# Altium project IMX8SoCIot.PrjPcb (part 1 of 4)
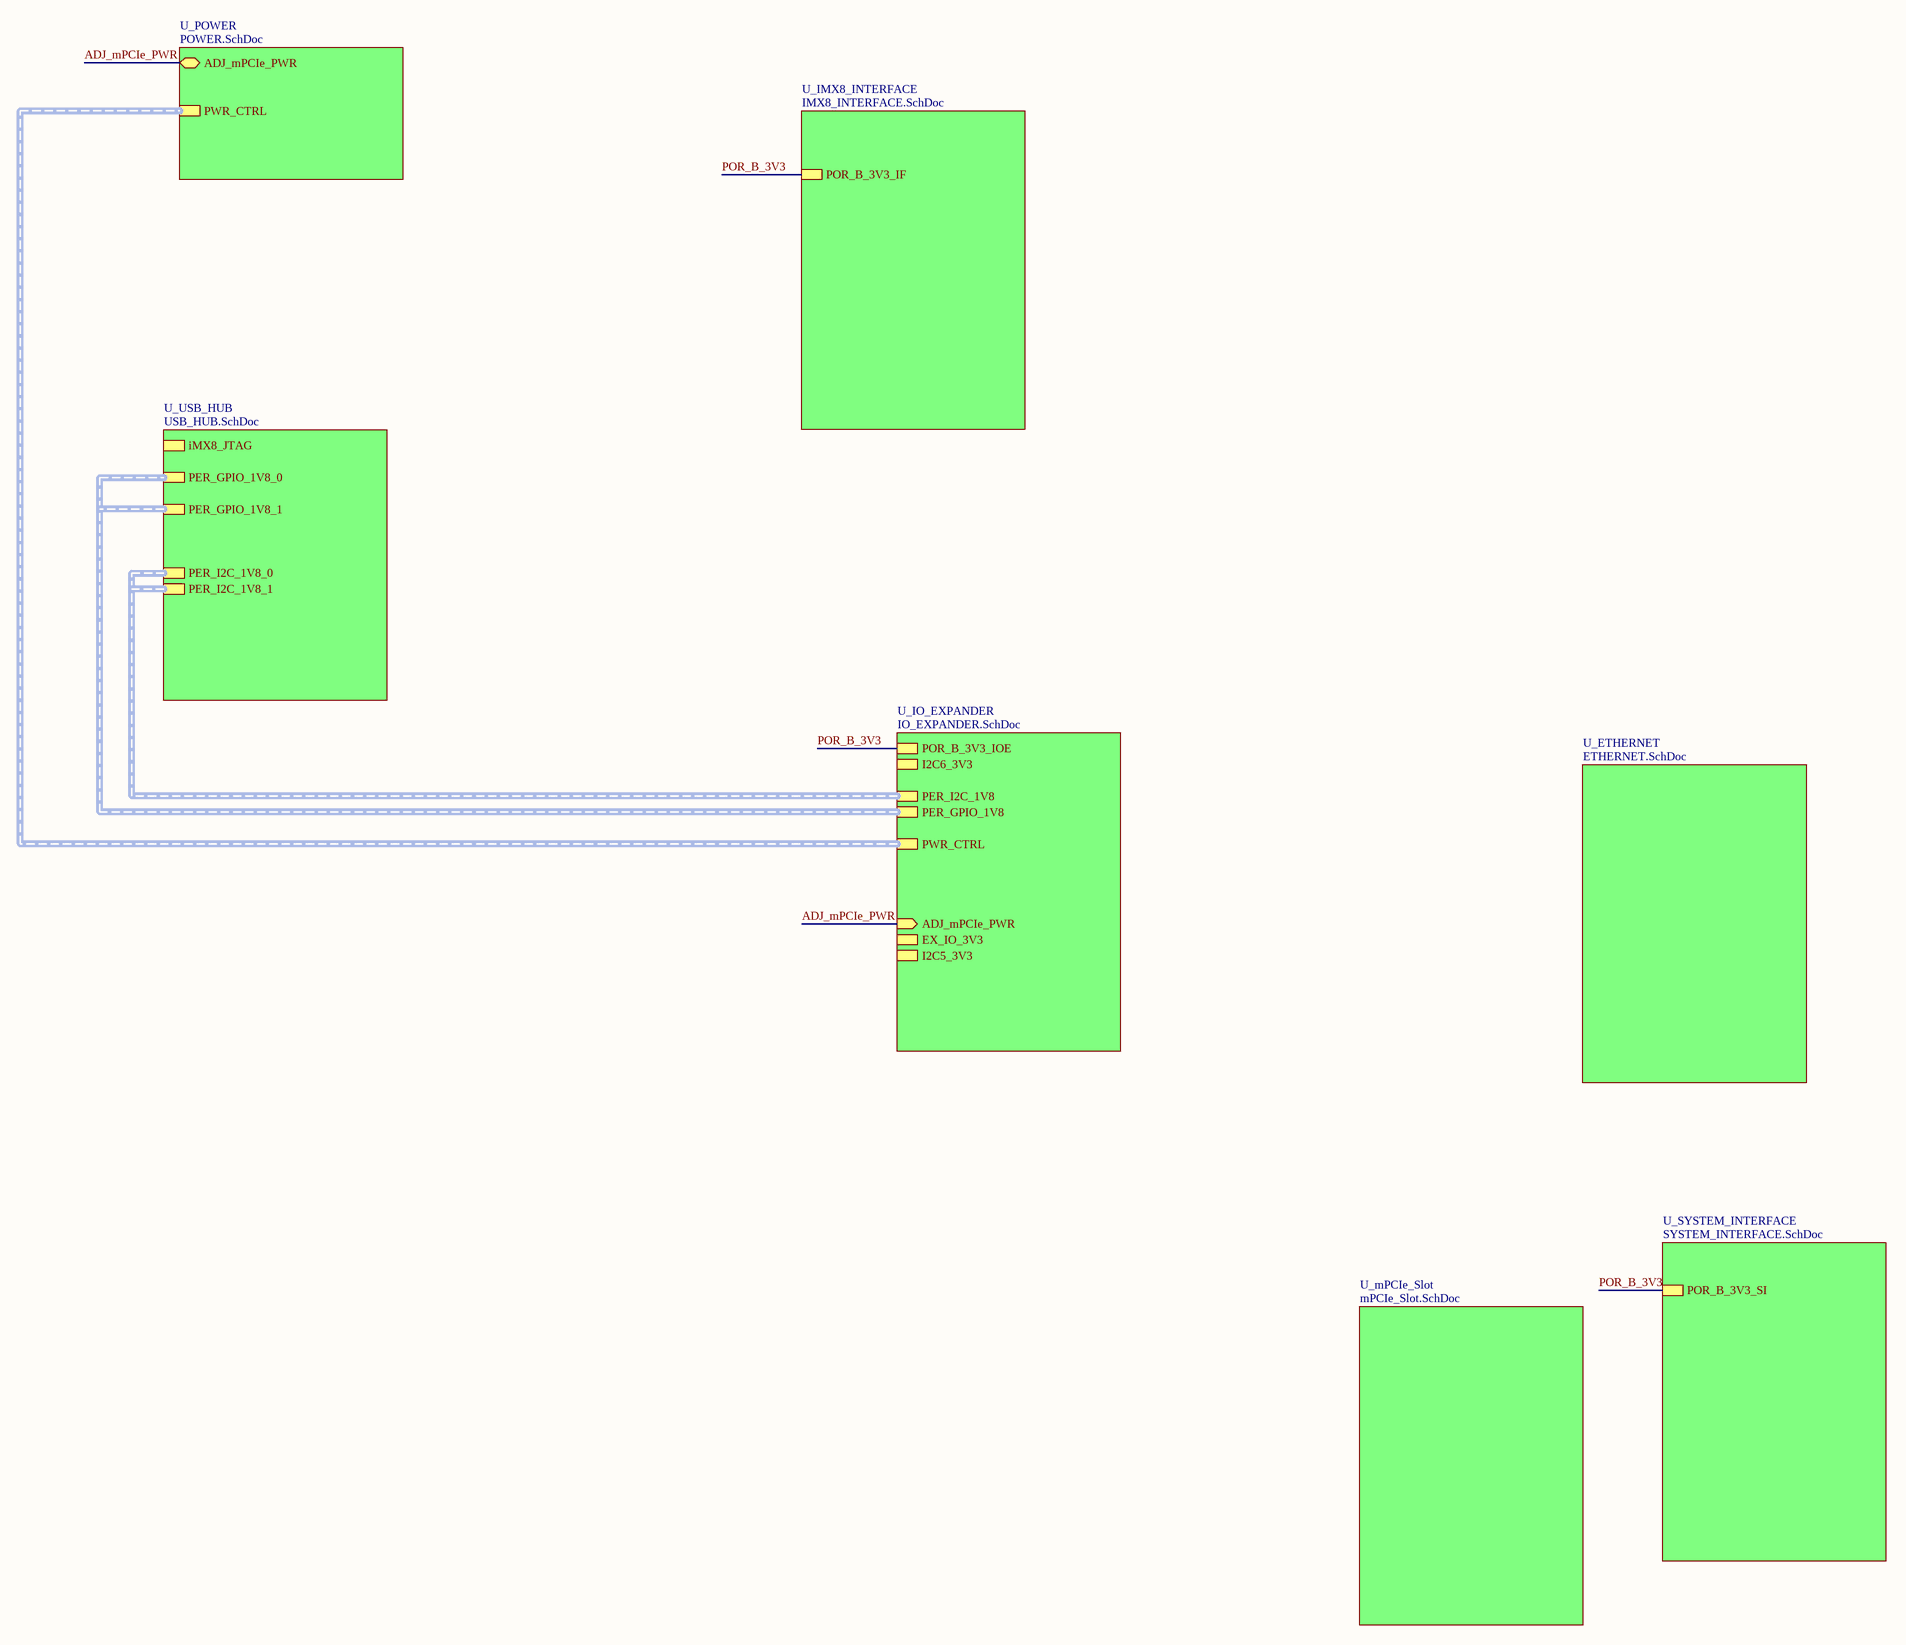
[diagram p0: TOP_LEVEL.SchDoc]
12 sheets, 243 parts. Net scope: global (net labels, ports and power ports of the same name join across sheets).
Board file: PCB1.PcbDoc
Sheets:
  TOP_LEVEL.SchDoc
    U_IMX8_INTERFACE = IMX8_INTERFACE.SchDoc
      U_IMX8_SOC = IMX8_SOC.SchDoc
        U_IMX8_DISPLAY = IMX8_DISPLAY.SchDoc
        U_IMX8_eMMC = IMX8_eMMC.SchDoc
        U_IMX8_INPUT = IMX8_INPUT.SchDoc
        U_IMX8_IO = IMX8_IO.SchDoc
        U_IMX8_LPDDR4 = IMX8_LPDDR4.SchDoc
        U_IMX8_PHY = IMX8_PHY.SchDoc
        U_IMX8_PMIC = IMX8_PMIC.SchDoc
        U_IMX8_PWR = IMX8_PWR.SchDoc
        U_Interconnect = Interconnect.SchDoc

## Sheet TOP_LEVEL.SchDoc
size 594 x 420 mm; SheetNumber: 1; SheetTotal: 20

### Sub-sheets
U_ETHERNET = ETHERNET.SchDoc (file not in this document): no entries
U_IMX8_INTERFACE = IMX8_INTERFACE.SchDoc: POR_B_3V3_IF
U_IO_EXPANDER = IO_EXPANDER.SchDoc (file not in this document): I2C6_3V3 (harness I2C6_3V3), PER_GPIO_1V8 (harness PER_GPIO_1V8), PER_I2C_1V8 (harness PER_I2C_1V8), ADJ_mPCIe_PWR (in), EX_IO_3V3 (harness EX_IO), I2C5_3V3 (harness I2C5_3V3), PWR_CTRL (harness PWR_CTRL_IOE), POR_B_3V3_IOE
U_mPCIe_Slot = mPCIe_Slot.SchDoc (file not in this document): no entries
U_POWER = POWER.SchDoc (file not in this document): ADJ_mPCIe_PWR (bidir), PWR_CTRL (harness PWR_CTRL_SMP)
U_SYSTEM_INTERFACE = SYSTEM_INTERFACE.SchDoc (file not in this document): POR_B_3V3_SI
U_USB_HUB = USB_HUB.SchDoc (file not in this document): iMX8_JTAG (harness iMX8_JTAG), PER_GPIO_1V8_0 (harness PER_GPIO_1V8_0), PER_GPIO_1V8_1 (harness PER_GPIO_1V8_1), PER_I2C_1V8_0 (harness PER_GPIO_1V8_0), PER_I2C_1V8_1 (harness PER_GPIO_1V8_1)

### Nets
ADJ_mPCIe_PWR: sheet U_POWER/ADJ_mPCIe_PWR, sheet U_IO_EXPANDER/ADJ_mPCIe_PWR
POR_B_3V3: sheet U_IMX8_INTERFACE/POR_B_3V3_IF, sheet U_IO_EXPANDER/POR_B_3V3_IOE, sheet U_SYSTEM_INTERFACE/POR_B_3V3_SI

### Buses and harness runs
harness sheet U_IO_EXPANDER/PER_GPIO_1V8 = sheet U_USB_HUB/PER_GPIO_1V8_0 = sheet U_USB_HUB/PER_GPIO_1V8_1
harness sheet U_IO_EXPANDER/PER_I2C_1V8 = sheet U_USB_HUB/PER_I2C_1V8_0 = sheet U_USB_HUB/PER_I2C_1V8_1
harness sheet U_IO_EXPANDER/PWR_CTRL = sheet U_POWER/PWR_CTRL

### Notes on the sheet
- DWG NO:
- REV:
- THIS DOCUMENT AND THE DATA DISCLOSED HEREIN OR
- HEREWITH IS THE PROPERTY OF ALTIUM LIMITED AND MAY
- BE FREELY DISTRIBUTED IN WHOLE. NO RIGHTS ARE
- RESERVED OR EXPRESS OR IMPLIED WARANTEE GIVEN.
- REVISION
- DESCRIPTION
- DATE
- APPROVED
- ENG:
- APPROVALS
- PROJECT
- DSN:
- CHK:
- REFERENCE DOCUMENTS
- PROJECT REVISION:
- TITLE
- DOCUMENT REVISION:
- DESIGN ITEM:
- BOM:
- FAB DWG:
- PCB DWG:
- ASSY DWG:
- SCALE:
- A2
- SIZE
- CAGE CODE
- FILE NAME
- DWG NO.
- SHEET
- OF
- REV

## Sheet IMX8_INTERFACE.SchDoc
size 594 x 420 mm; SheetNumber: 2; SheetTotal: 12
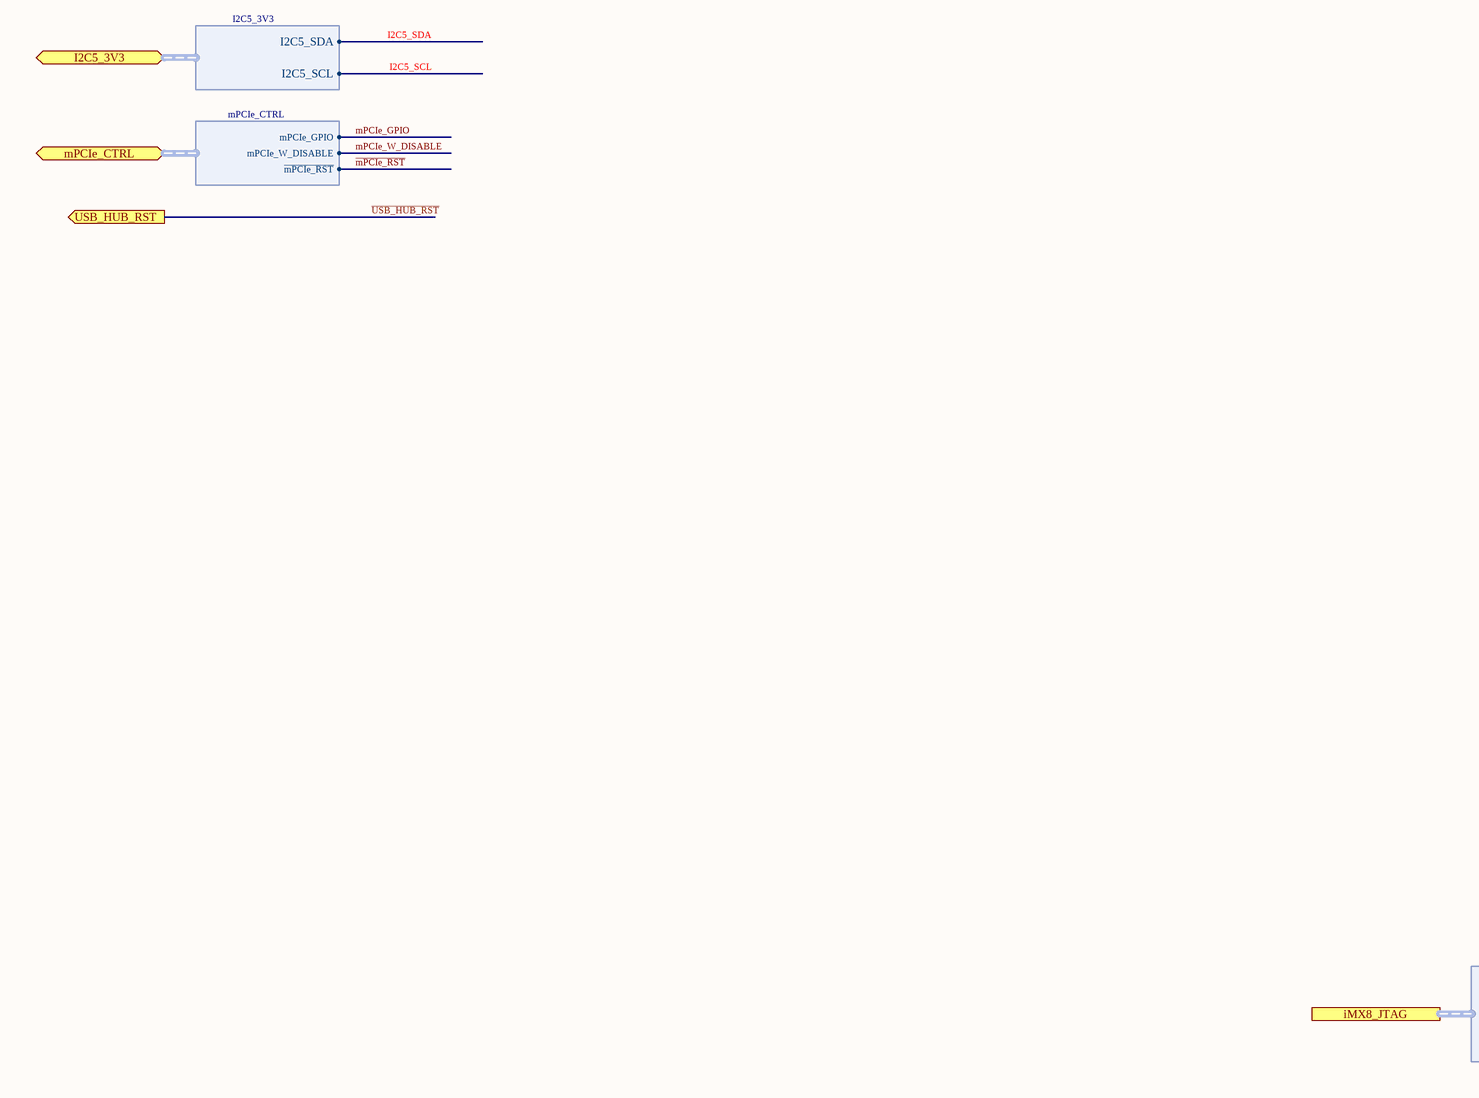
[diagram p1: IMX8_INTERFACE.SchDoc, bottom left]
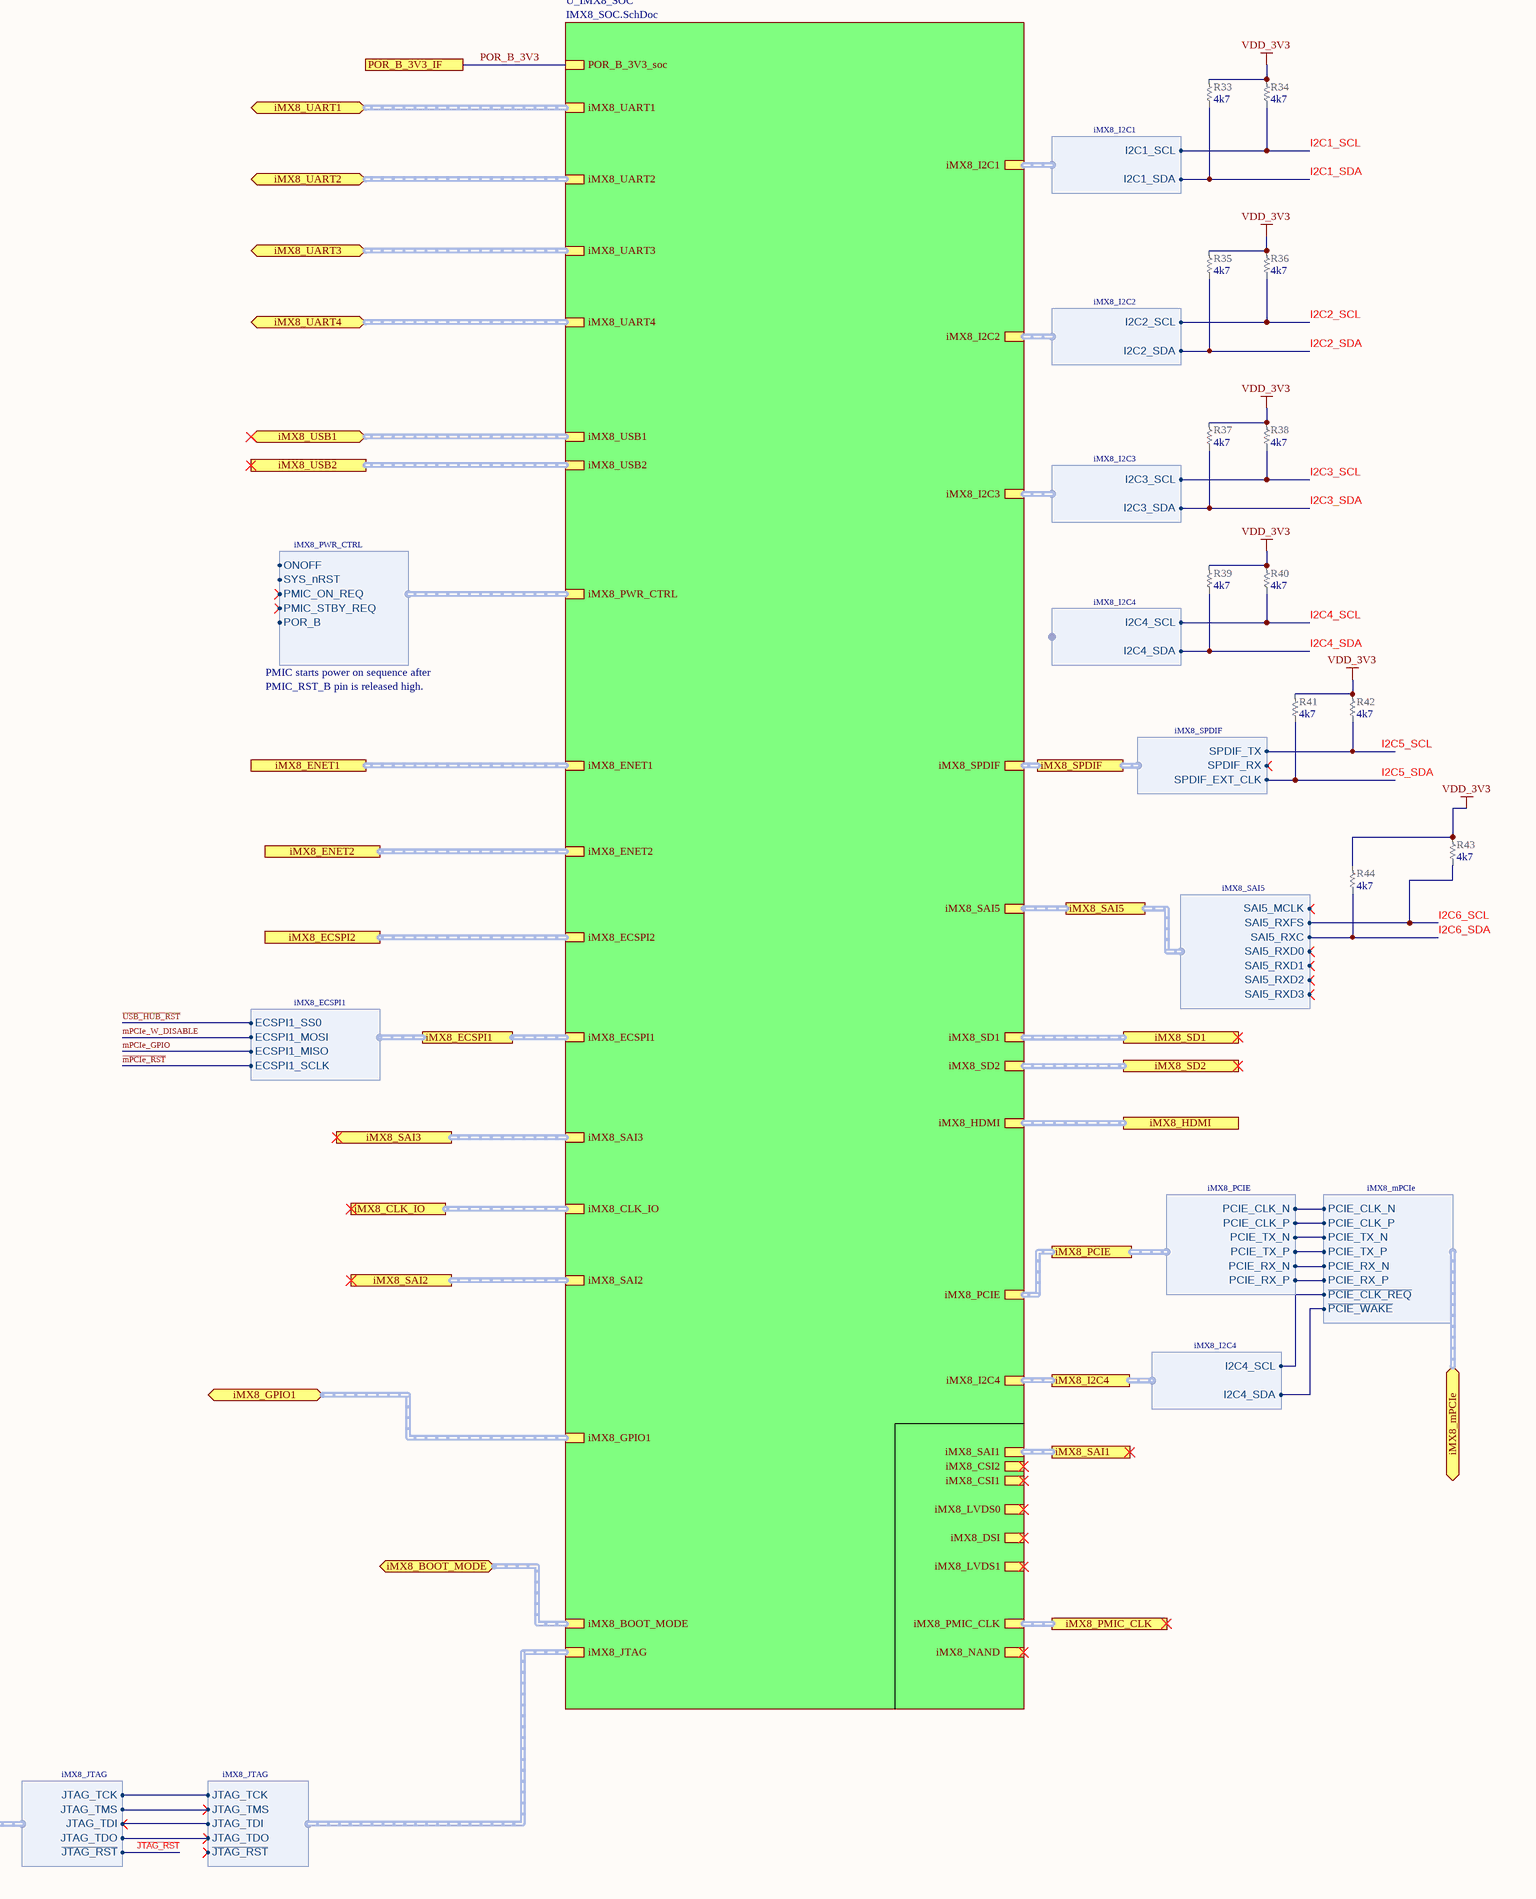
[diagram p2: IMX8_INTERFACE.SchDoc, bottom right]

### Parts
R33  value 4k7  [RES_0201_UN1Q]  (hidden comment: RES_0201_4k7)
R34  value 4k7  [RES_0201_UN1Q]  (hidden comment: RES_0201_4k7)
R35  value 4k7  [RES_0201_UN1Q]  (hidden comment: RES_0201_4k7)
R36  value 4k7  [RES_0201_UN1Q]  (hidden comment: RES_0201_4k7)
R37  value 4k7  [RES_0201_UN1Q]  (hidden comment: RES_0201_4k7)
R38  value 4k7  [RES_0201_UN1Q]  (hidden comment: RES_0201_4k7)
R39  value 4k7  [RES_0201_UN1Q]  (hidden comment: RES_0201_4k7)
R40  value 4k7  [RES_0201_UN1Q]  (hidden comment: RES_0201_4k7)
R41  value 4k7  [RES_0201_UN1Q]  (hidden comment: RES_0201_4k7)
R42  value 4k7  [RES_0201_UN1Q]  (hidden comment: RES_0201_4k7)
R43  value 4k7  [RES_0201_UN1Q]  (hidden comment: RES_0201_4k7)
R44  value 4k7  [RES_0201_UN1Q]  (hidden comment: RES_0201_4k7)

### Sub-sheets
U_IMX8_SOC = IMX8_SOC.SchDoc: iMX8_USB1 (harness iMX8_USB1), iMX8_USB2 (harness iMX8_USB2), iMX8_SD1 (harness iMX8_SD1), iMX8_SD2 (harness iMX8_SD2), iMX8_NAND (harness iMX8_PCIE), iMX8_PCIE (harness iMX8_PCIE), iMX8_DSI (harness iMX8_DSI), iMX8_LVDS0 (harness iMX8_LVDS0), iMX8_LVDS1 (harness iMX8_LVDS1), iMX8_CSI1 (harness iMX8_CSI1), iMX8_CSI2 (harness iMX8_CSI2), iMX8_HDMI (harness iMX8_HDMI), iMX8_UART1 (harness iMX8_UART1), iMX8_UART2 (harness iMX8_UART2), iMX8_UART3 (harness iMX8_UART3), iMX8_UART4 (harness iMX8_UART4), iMX8_I2C1 (harness iMX8_I2C1), iMX8_I2C2 (harness iMX8_I2C2), iMX8_I2C3 (harness iMX8_I2C3), iMX8_SAI1 (harness iMX8_SAI1), iMX8_SAI2 (harness iMX8_SAI2), iMX8_SAI5 (harness iMX8_SAI5), iMX8_SAI3 (harness iMX8_SAI3), iMX8_ENET1, iMX8_ENET2 (harness iMX8_ENET), iMX8_ECSPI2 (harness iMX8_ECSPI2), iMX8_GPIO1 (harness iMX8_GPIO1), iMX8_SPDIF (harness iMX8_SPDIF), iMX8_BOOT_MODE (harness iMX8_BOOT_MODE), iMX8_JTAG (harness iMX8_JTAG), iMX8_PMIC_CLK (harness iMX8_PMIC_CLK), iMX8_PWR_CTRL (harness iMX8_PWR_CTRL), iMX8_I2C4 (harness iMX8_I2C4), iMX8_ECSPI1 (harness iMX8_ECSPI1), POR_B_3V3_soc, iMX8_CLK_IO (harness iMX8_CLK_IO_sub)

### Ports
I2C5_3V3 (bidir, harness I2C5_3V3), iMX8_BOOT_MODE (bidir, harness iMX8_BOOT_MODE), iMX8_CLK_IO (harness iMX8_CLK_IO_sub), iMX8_ECSPI1 (harness iMX8_ECSPI1), iMX8_ECSPI2 (harness iMX8_ECSPI2), iMX8_ENET1, iMX8_ENET2 (harness iMX8_ENET), iMX8_GPIO1 (bidir, harness iMX8_GPIO1), iMX8_HDMI (harness iMX8_HDMI), iMX8_I2C4 (harness iMX8_I2C4), iMX8_JTAG (harness iMX8_JTAG), iMX8_mPCIe (bidir, harness iMX8_mPCIe), iMX8_PCIE (harness iMX8_PCIE), iMX8_PMIC_CLK (harness iMX8_PMIC_CLK), iMX8_SAI1 (harness iMX8_SAI1), iMX8_SAI2 (harness iMX8_SAI2), iMX8_SAI3 (harness iMX8_SAI3), iMX8_SAI5 (harness iMX8_SAI5), iMX8_SD1 (harness iMX8_SD1), iMX8_SD2 (harness iMX8_SD2), iMX8_SPDIF (harness iMX8_SPDIF), iMX8_UART1 (bidir, harness iMX8_UART1), iMX8_UART2 (bidir, harness iMX8_UART2), iMX8_UART3 (bidir, harness iMX8_UART3), iMX8_UART4 (bidir, harness iMX8_UART4), iMX8_USB1 (bidir, harness iMX8_USB1), iMX8_USB2 (harness iMX8_USB2), mPCIe_CTRL (bidir, harness mPCIe_CTRL), POR_B_3V3_IF, USB_HUB_RST (out)

### Harnesses
iMX8_JTAG: JTAG_TCK, JTAG_TMS, JTAG_TDI, JTAG_TDO, ~{JTAG_RST}
iMX8_PWR_CTRL: ONOFF, POR_B, PMIC_ON_REQ, PMIC_STBY_REQ, SYS_nRST
iMX8_I2C1: I2C1_SCL, I2C1_SDA
iMX8_I2C2: I2C2_SCL, I2C2_SDA
iMX8_I2C3: I2C3_SCL, I2C3_SDA
iMX8_I2C4: I2C4_SCL, I2C4_SDA
iMX8_SAI5: SAI5_MCLK, SAI5_RXFS, SAI5_RXC, SAI5_RXD0, SAI5_RXD1, SAI5_RXD2, SAI5_RXD3
iMX8_SPDIF: SPDIF_TX, SPDIF_RX, SPDIF_EXT_CLK
I2C5_3V3: I2C5_SDA, I2C5_SCL
iMX8_PCIE: PCIE_CLK_N, PCIE_CLK_P, PCIE_TX_N, PCIE_TX_P, PCIE_RX_N, PCIE_RX_P
iMX8_mPCIe: PCIE_CLK_N, PCIE_CLK_P, PCIE_TX_N, PCIE_TX_P, PCIE_RX_N, PCIE_RX_P, ~{PCIE_CLK_REQ}, ~{PCIE_WAKE}
mPCIe_CTRL: mPCIe_GPIO, ~{mPCIe_RST}, mPCIe_W_DISABLE
iMX8_ECSPI1: ECSPI1_SS0, ECSPI1_MOSI, ECSPI1_MISO, ECSPI1_SCLK

### Nets
VDD_3V3: R33.2 R34.2 R35.2 R36.2 R37.2 R38.2 R39.2 R40.2 R41.2 R42.2 R43.2 R44.2
~{mPCIe_RST}: port mPCIe_CTRL.~{mPCIe_RST}, port iMX8_ECSPI1.ECSPI1_SCLK
~{USB_HUB_RST}: port USB_HUB_RST, port iMX8_ECSPI1.ECSPI1_SS0
I2C1_SCL: R34.1 ; sheet U_IMX8_SOC/iMX8_I2C1.I2C1_SCL
I2C1_SDA: R33.1 ; sheet U_IMX8_SOC/iMX8_I2C1.I2C1_SDA
I2C2_SCL: R36.1 ; sheet U_IMX8_SOC/iMX8_I2C2.I2C2_SCL
I2C2_SDA: R35.1 ; sheet U_IMX8_SOC/iMX8_I2C2.I2C2_SDA
I2C3_SCL: R38.1 ; sheet U_IMX8_SOC/iMX8_I2C3.I2C3_SCL
I2C3_SDA: R37.1 ; sheet U_IMX8_SOC/iMX8_I2C3.I2C3_SDA
I2C4_SCL: R40.1 ; harness iMX8_I2C4.I2C4_SCL, port iMX8_I2C4.I2C4_SCL, port iMX8_mPCIe.~{PCIE_CLK_REQ}
I2C4_SDA: R39.1 ; harness iMX8_I2C4.I2C4_SDA, port iMX8_I2C4.I2C4_SDA, port iMX8_mPCIe.~{PCIE_WAKE}
I2C5_SCL: R42.1 ; port iMX8_SPDIF.SPDIF_TX, port I2C5_3V3.I2C5_SCL
I2C5_SDA: R41.1 ; port iMX8_SPDIF.SPDIF_EXT_CLK, port I2C5_3V3.I2C5_SDA
I2C6_SCL: R43.1 ; port iMX8_SAI5.SAI5_RXFS
I2C6_SDA: R44.1 ; port iMX8_SAI5.SAI5_RXC
JTAG_TCK: port iMX8_JTAG.JTAG_TCK, sheet U_IMX8_SOC/iMX8_JTAG.JTAG_TCK
JTAG_TDI: port iMX8_JTAG.JTAG_TDI, sheet U_IMX8_SOC/iMX8_JTAG.JTAG_TDI
JTAG_TDO: port iMX8_JTAG.JTAG_TDO, sheet U_IMX8_SOC/iMX8_JTAG.JTAG_TDO
JTAG_TMS: port iMX8_JTAG.JTAG_TMS, sheet U_IMX8_SOC/iMX8_JTAG.JTAG_TMS
mPCIe_GPIO: port mPCIe_CTRL.mPCIe_GPIO, port iMX8_ECSPI1.ECSPI1_MISO  [project net ECSPI1_MISO]
mPCIe_W_DISABLE: port mPCIe_CTRL.mPCIe_W_DISABLE, port iMX8_ECSPI1.ECSPI1_MOSI  [project net ECSPI1_MOSI]
PCIE_CLK_N: port iMX8_PCIE.PCIE_CLK_N, port iMX8_mPCIe.PCIE_CLK_N
PCIE_CLK_P: port iMX8_PCIE.PCIE_CLK_P, port iMX8_mPCIe.PCIE_CLK_P
PCIE_RX_N: port iMX8_PCIE.PCIE_RX_N, port iMX8_mPCIe.PCIE_RX_N
PCIE_RX_P: port iMX8_PCIE.PCIE_RX_P, port iMX8_mPCIe.PCIE_RX_P
PCIE_TX_N: port iMX8_PCIE.PCIE_TX_N, port iMX8_mPCIe.PCIE_TX_N
PCIE_TX_P: port iMX8_PCIE.PCIE_TX_P, port iMX8_mPCIe.PCIE_TX_P
POR_B_3V3: port POR_B_3V3_IF, sheet U_IMX8_SOC/POR_B_3V3_soc

### Buses and harness runs
harness port iMX8_BOOT_MODE = sheet U_IMX8_SOC/iMX8_BOOT_MODE
harness port iMX8_CLK_IO = sheet U_IMX8_SOC/iMX8_CLK_IO
harness port iMX8_ECSPI1 = sheet U_IMX8_SOC/iMX8_ECSPI1
harness port iMX8_ECSPI2 = sheet U_IMX8_SOC/iMX8_ECSPI2
harness port iMX8_ENET1 = sheet U_IMX8_SOC/iMX8_ENET1
harness port iMX8_ENET2 = sheet U_IMX8_SOC/iMX8_ENET2
harness port iMX8_GPIO1 = sheet U_IMX8_SOC/iMX8_GPIO1
harness port iMX8_HDMI = sheet U_IMX8_SOC/iMX8_HDMI
harness port iMX8_I2C4 = sheet U_IMX8_SOC/iMX8_I2C4
harness port iMX8_PCIE = sheet U_IMX8_SOC/iMX8_PCIE
harness port iMX8_PMIC_CLK = sheet U_IMX8_SOC/iMX8_PMIC_CLK
harness port iMX8_SAI1 = sheet U_IMX8_SOC/iMX8_SAI1
harness port iMX8_SAI2 = sheet U_IMX8_SOC/iMX8_SAI2
harness port iMX8_SAI3 = sheet U_IMX8_SOC/iMX8_SAI3
harness port iMX8_SAI5 = sheet U_IMX8_SOC/iMX8_SAI5
harness port iMX8_SD1 = sheet U_IMX8_SOC/iMX8_SD1
harness port iMX8_SD2 = sheet U_IMX8_SOC/iMX8_SD2
harness port iMX8_SPDIF = sheet U_IMX8_SOC/iMX8_SPDIF
harness port iMX8_UART1 = sheet U_IMX8_SOC/iMX8_UART1
harness port iMX8_UART2 = sheet U_IMX8_SOC/iMX8_UART2
harness port iMX8_UART3 = sheet U_IMX8_SOC/iMX8_UART3
harness port iMX8_UART4 = sheet U_IMX8_SOC/iMX8_UART4
harness port iMX8_USB1 = sheet U_IMX8_SOC/iMX8_USB1
harness port iMX8_USB2 = sheet U_IMX8_SOC/iMX8_USB2

### Notes on the sheet
- PMIC starts power on sequence after
- PMIC_RST_B pin is released high.
- DWG NO:
- REV:
- THIS DOCUMENT AND THE DATA DISCLOSED HEREIN OR
- HEREWITH IS THE PROPERTY OF ALTIUM LIMITED AND MAY
- BE FREELY DISTRIBUTED IN WHOLE. NO RIGHTS ARE
- RESERVED OR EXPRESS OR IMPLIED WARANTEE GIVEN.
- REVISION
- DESCRIPTION
- DATE
- APPROVED
- ENG:
- APPROVALS
- PROJECT
- DSN:
- CHK:
- REFERENCE DOCUMENTS
- PROJECT REVISION:
- TITLE
- DOCUMENT REVISION:
- DESIGN ITEM:
- BOM:
- FAB DWG:
- PCB DWG:
- ASSY DWG:
- SCALE:
- A2
- SIZE
- CAGE CODE
- FILE NAME
- DWG NO.
- SHEET
- OF
- REV

### Library data of the parts
R33-R44 = CMP-001-000475-13: RES; Part Number: RC0201FR-074K7L; Manufacturer: Yageo Group; Power Rating: 1/20W; Sort order: 322; HasBeenBuilt: TBD; Alternative component: Allowed; Tolerance: 1%; System: RLC; Package: 0201; ClassName: SMALL; ComponentLink1Description: 1_Datasheet; ComponentLink2Description: 2_Product page; ComponentLink3Description: 3_X-information; ComponentLink4Description: 4_X-information; Creation date: 20190101; Source: RLC_UN1Q.SchLib; Manufacturer Part Number: RC0201FR-074K7L; Component Type: Resistor

## Sheet IMX8_SOC.SchDoc
size 594 x 420 mm; SheetNumber: 3; SheetTotal: 12
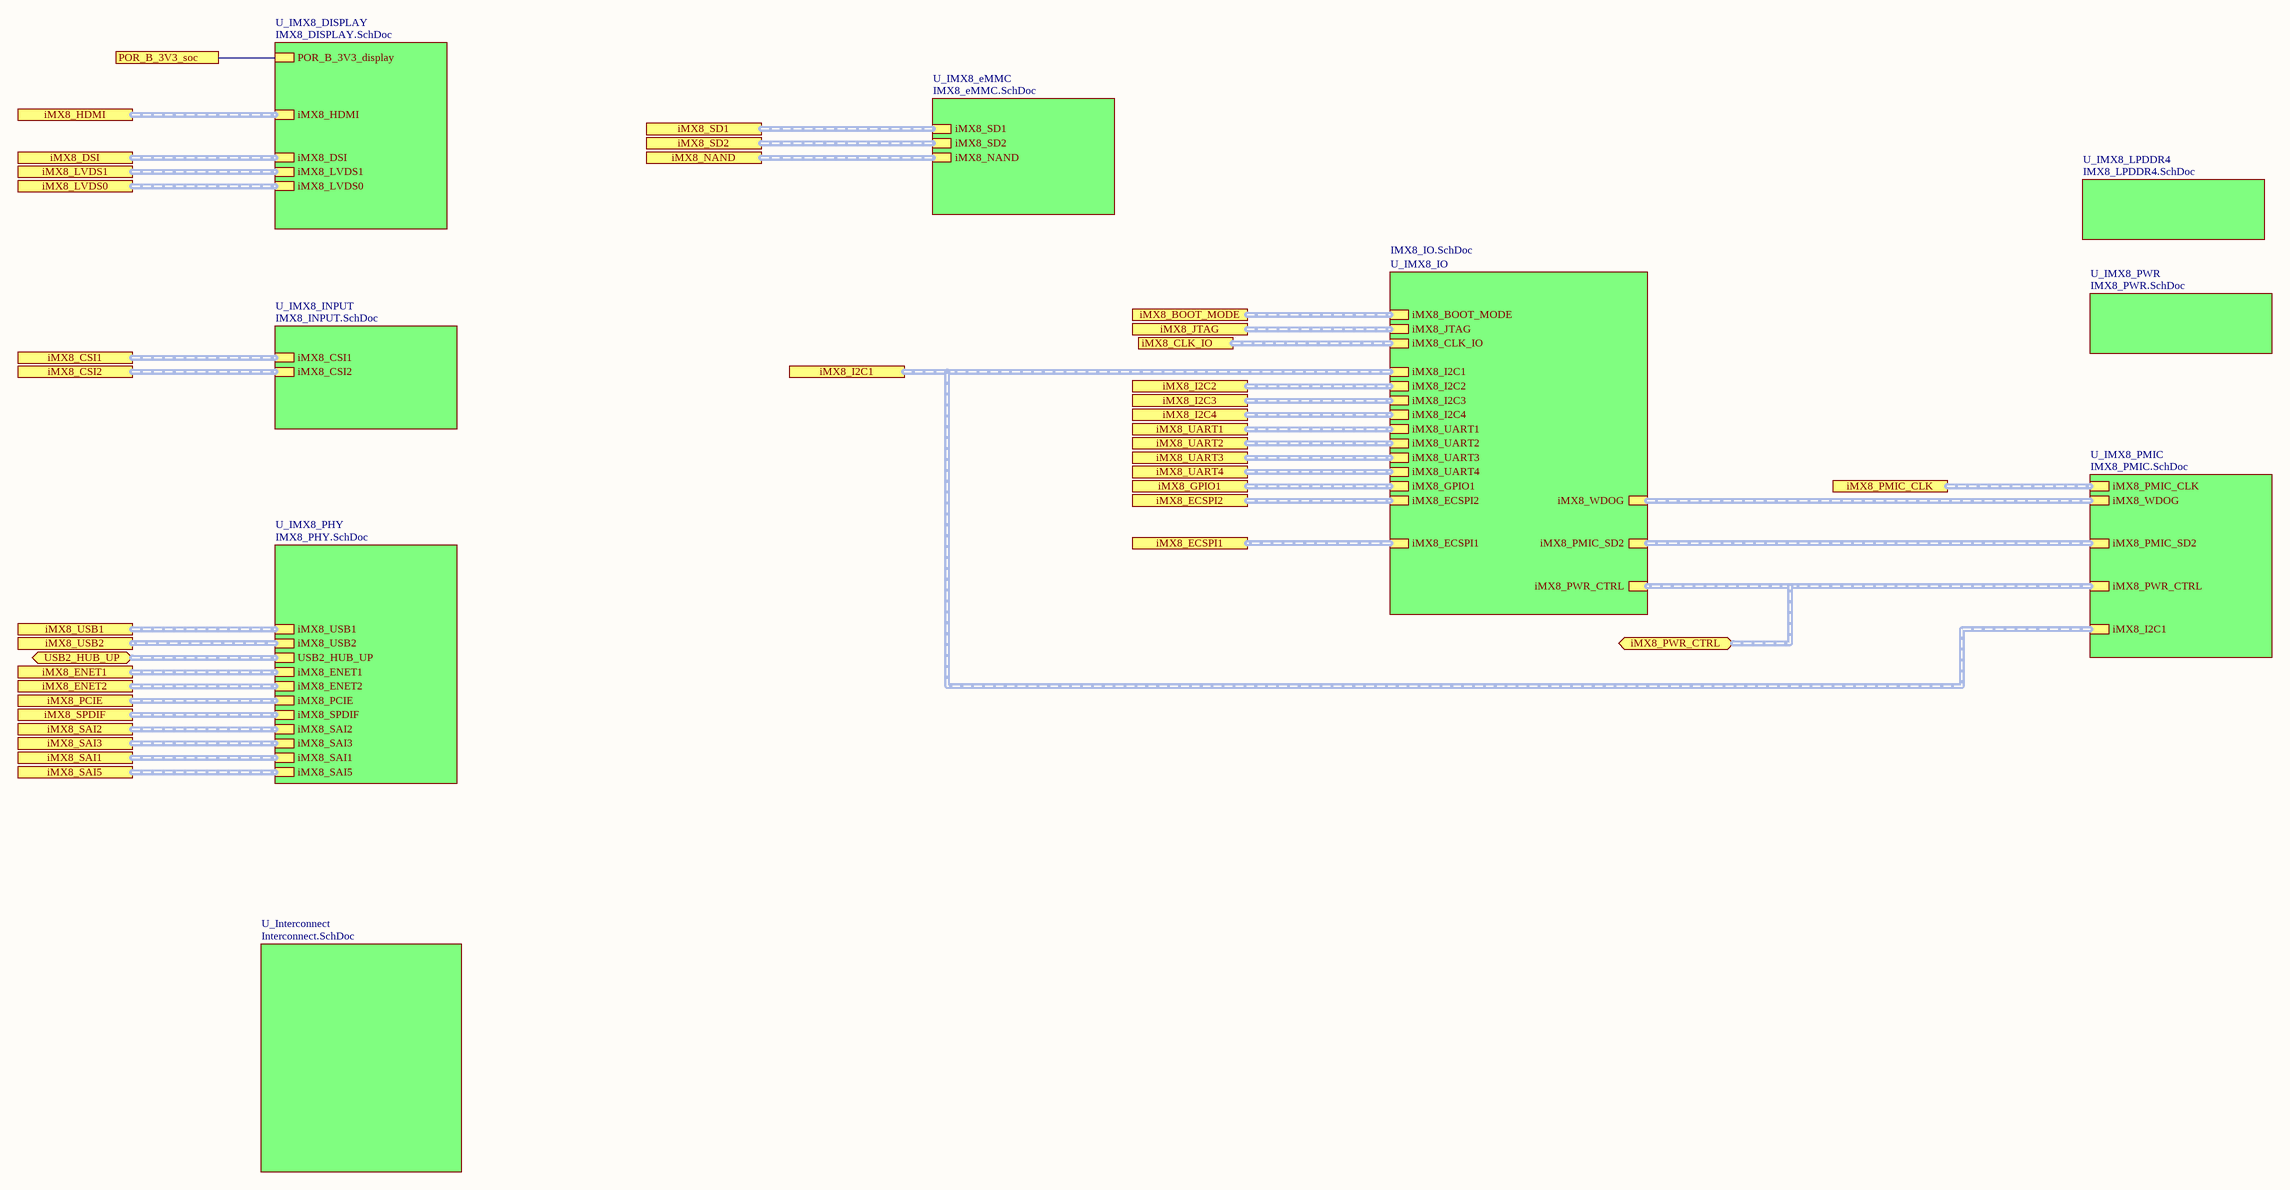
[diagram p3: IMX8_SOC.SchDoc]

### Sub-sheets
U_IMX8_DISPLAY = IMX8_DISPLAY.SchDoc: iMX8_LVDS0 (harness iMX8_LVDS0), iMX8_LVDS1 (harness iMX8_LVDS1), iMX8_DSI (harness iMX8_DSI), iMX8_HDMI (harness iMX8_HDMI), POR_B_3V3_display
U_IMX8_eMMC = IMX8_eMMC.SchDoc: iMX8_SD1 (harness iMX8_SD1), iMX8_SD2 (harness iMX8_SD2), iMX8_NAND (harness iMX8_NAND)
U_IMX8_INPUT = IMX8_INPUT.SchDoc: iMX8_CSI1 (harness iMX8_CSI1), iMX8_CSI2 (harness iMX8_CSI2)
U_IMX8_IO = IMX8_IO.SchDoc: iMX8_BOOT_MODE (harness iMX8_BOOT_MODE), iMX8_JTAG (harness iMX8_JTAG), iMX8_CLK_IO (harness iMX8_CLK_IO_sub), iMX8_PWR_CTRL (harness iMX8_PWR_CTRL), iMX8_I2C1 (harness iMX8_I2C1), iMX8_I2C2 (harness iMX8_I2C2), iMX8_I2C3 (harness iMX8_I2C3), iMX8_I2C4 (harness iMX8_I2C4), iMX8_UART1 (harness iMX8_UART1), iMX8_UART2 (harness iMX8_UART2), iMX8_UART3 (harness iMX8_UART3), iMX8_UART4 (harness iMX8_UART4), iMX8_GPIO1 (harness iMX8_GPIO1), iMX8_ECSPI2 (harness iMX8_ECSPI2), iMX8_WDOG (harness iMX8_WDOG), iMX8_PMIC_SD2 (harness iMX8_PMIC_SD2), iMX8_ECSPI1 (harness iMX8_ECSPI1)
U_IMX8_LPDDR4 = IMX8_LPDDR4.SchDoc: no entries
U_IMX8_PHY = IMX8_PHY.SchDoc: iMX8_USB1 (harness iMX8_USB1), iMX8_USB2 (harness iMX8_USB2), USB2_HUB_UP (harness USB2_HUB_UP), iMX8_ENET1 (harness iMX8_ENET1), iMX8_ENET2 (harness iMX8_ENET2), iMX8_PCIE (harness iMX8_PCIE), iMX8_SPDIF (harness iMX8_SPDIF), iMX8_SAI2 (harness iMX8_SAI2), iMX8_SAI3 (harness iMX8_SAI3), iMX8_SAI1 (harness iMX8_SAI1), iMX8_SAI5 (harness iMX8_SAI5)
U_IMX8_PMIC = IMX8_PMIC.SchDoc: iMX8_PMIC_CLK (harness iMX8_PMIC_CLK), iMX8_WDOG (harness iMX8_WDOG), iMX8_I2C1 (harness iMX8_I2C1), iMX8_PWR_CTRL (harness iMX8_PWR_CTRL), iMX8_PMIC_SD2 (harness iMX8_PMIC_SD2)
U_IMX8_PWR = IMX8_PWR.SchDoc: no entries
U_Interconnect = Interconnect.SchDoc: no entries

### Ports
iMX8_BOOT_MODE (harness iMX8_BOOT_MODE), iMX8_CLK_IO (harness iMX8_CLK_IO_sub), iMX8_CSI1 (harness iMX8_CSI1), iMX8_CSI2 (harness iMX8_CSI2), iMX8_DSI (harness iMX8_DSI), iMX8_ECSPI1 (harness iMX8_ECSPI1), iMX8_ECSPI2 (harness iMX8_ECSPI2), iMX8_ENET1, iMX8_ENET2 (harness iMX8_ENET), iMX8_GPIO1 (harness iMX8_GPIO1), iMX8_HDMI (harness iMX8_HDMI), iMX8_I2C1 (harness iMX8_I2C1), iMX8_I2C2 (harness iMX8_I2C2), iMX8_I2C3 (harness iMX8_I2C3), iMX8_I2C4 (harness iMX8_I2C4), iMX8_JTAG (harness iMX8_JTAG), iMX8_LVDS0 (harness iMX8_LVDS0), iMX8_LVDS1 (harness iMX8_LVDS1), iMX8_NAND (harness iMX8_PCIE), iMX8_PCIE (harness iMX8_PCIE), iMX8_PMIC_CLK (harness iMX8_PMIC_CLK), iMX8_PWR_CTRL (bidir, harness iMX8_PWR_CTRL), iMX8_SAI1 (harness iMX8_SAI1), iMX8_SAI2 (harness iMX8_SAI2), iMX8_SAI3 (harness iMX8_SAI3), iMX8_SAI5 (harness iMX8_SAI5), iMX8_SD1 (harness iMX8_SD1), iMX8_SD2 (harness iMX8_SD2), iMX8_SPDIF (harness iMX8_SPDIF), iMX8_UART1 (harness iMX8_UART1), iMX8_UART2 (harness iMX8_UART2), iMX8_UART3 (harness iMX8_UART3), iMX8_UART4 (harness iMX8_UART4), iMX8_USB1 (harness iMX8_USB1), iMX8_USB2 (harness iMX8_USB2), POR_B_3V3_soc, USB2_HUB_UP (bidir, harness USB2_HUB_UP)

### Nets
POR_B_3V3_soc: port POR_B_3V3_soc, sheet U_IMX8_DISPLAY/POR_B_3V3_display

### Buses and harness runs
harness port iMX8_BOOT_MODE = sheet U_IMX8_IO/iMX8_BOOT_MODE
harness port iMX8_CLK_IO = sheet U_IMX8_IO/iMX8_CLK_IO
harness port iMX8_CSI1 = sheet U_IMX8_INPUT/iMX8_CSI1
harness port iMX8_CSI2 = sheet U_IMX8_INPUT/iMX8_CSI2
harness port iMX8_DSI = sheet U_IMX8_DISPLAY/iMX8_DSI
harness port iMX8_ECSPI1 = sheet U_IMX8_IO/iMX8_ECSPI1
harness port iMX8_ECSPI2 = sheet U_IMX8_IO/iMX8_ECSPI2
harness port iMX8_ENET1 = sheet U_IMX8_PHY/iMX8_ENET1
harness port iMX8_ENET2 = sheet U_IMX8_PHY/iMX8_ENET2
harness port iMX8_GPIO1 = sheet U_IMX8_IO/iMX8_GPIO1
harness port iMX8_HDMI = sheet U_IMX8_DISPLAY/iMX8_HDMI
harness port iMX8_I2C1 = sheet U_IMX8_IO/iMX8_I2C1 = sheet U_IMX8_PMIC/iMX8_I2C1
harness port iMX8_I2C2 = sheet U_IMX8_IO/iMX8_I2C2
harness port iMX8_I2C3 = sheet U_IMX8_IO/iMX8_I2C3
harness port iMX8_I2C4 = sheet U_IMX8_IO/iMX8_I2C4
harness port iMX8_JTAG = sheet U_IMX8_IO/iMX8_JTAG
harness port iMX8_LVDS0 = sheet U_IMX8_DISPLAY/iMX8_LVDS0
harness port iMX8_LVDS1 = sheet U_IMX8_DISPLAY/iMX8_LVDS1
harness port iMX8_NAND = sheet U_IMX8_eMMC/iMX8_NAND
harness port iMX8_PCIE = sheet U_IMX8_PHY/iMX8_PCIE
harness port iMX8_PMIC_CLK = sheet U_IMX8_PMIC/iMX8_PMIC_CLK
harness port iMX8_PWR_CTRL = sheet U_IMX8_IO/iMX8_PWR_CTRL = sheet U_IMX8_PMIC/iMX8_PWR_CTRL
harness port iMX8_SAI1 = sheet U_IMX8_PHY/iMX8_SAI1
harness port iMX8_SAI2 = sheet U_IMX8_PHY/iMX8_SAI2
harness port iMX8_SAI3 = sheet U_IMX8_PHY/iMX8_SAI3
harness port iMX8_SAI5 = sheet U_IMX8_PHY/iMX8_SAI5
harness port iMX8_SD1 = sheet U_IMX8_eMMC/iMX8_SD1
harness port iMX8_SD2 = sheet U_IMX8_eMMC/iMX8_SD2
harness port iMX8_SPDIF = sheet U_IMX8_PHY/iMX8_SPDIF
harness port iMX8_UART1 = sheet U_IMX8_IO/iMX8_UART1
harness port iMX8_UART2 = sheet U_IMX8_IO/iMX8_UART2
harness port iMX8_UART3 = sheet U_IMX8_IO/iMX8_UART3
harness port iMX8_UART4 = sheet U_IMX8_IO/iMX8_UART4
harness port iMX8_USB1 = sheet U_IMX8_PHY/iMX8_USB1
harness port iMX8_USB2 = sheet U_IMX8_PHY/iMX8_USB2
harness port USB2_HUB_UP = sheet U_IMX8_PHY/USB2_HUB_UP
harness sheet U_IMX8_IO/iMX8_PMIC_SD2 = sheet U_IMX8_PMIC/iMX8_PMIC_SD2
harness sheet U_IMX8_IO/iMX8_WDOG = sheet U_IMX8_PMIC/iMX8_WDOG

### Notes on the sheet
- DWG NO:
- REV:
- THIS DOCUMENT AND THE DATA DISCLOSED HEREIN OR
- HEREWITH IS THE PROPERTY OF ALTIUM LIMITED AND MAY
- BE FREELY DISTRIBUTED IN WHOLE. NO RIGHTS ARE
- RESERVED OR EXPRESS OR IMPLIED WARANTEE GIVEN.
- REVISION
- DESCRIPTION
- DATE
- APPROVED
- ENG:
- APPROVALS
- PROJECT
- DSN:
- CHK:
- REFERENCE DOCUMENTS
- PROJECT REVISION:
- TITLE
- DOCUMENT REVISION:
- DESIGN ITEM:
- BOM:
- FAB DWG:
- PCB DWG:
- ASSY DWG:
- SCALE:
- A2
- SIZE
- CAGE CODE
- FILE NAME
- DWG NO.
- SHEET
- OF
- REV

## Sheet IMX8_DISPLAY.SchDoc
size 594 x 420 mm; SheetNumber: 8; SheetTotal: 12
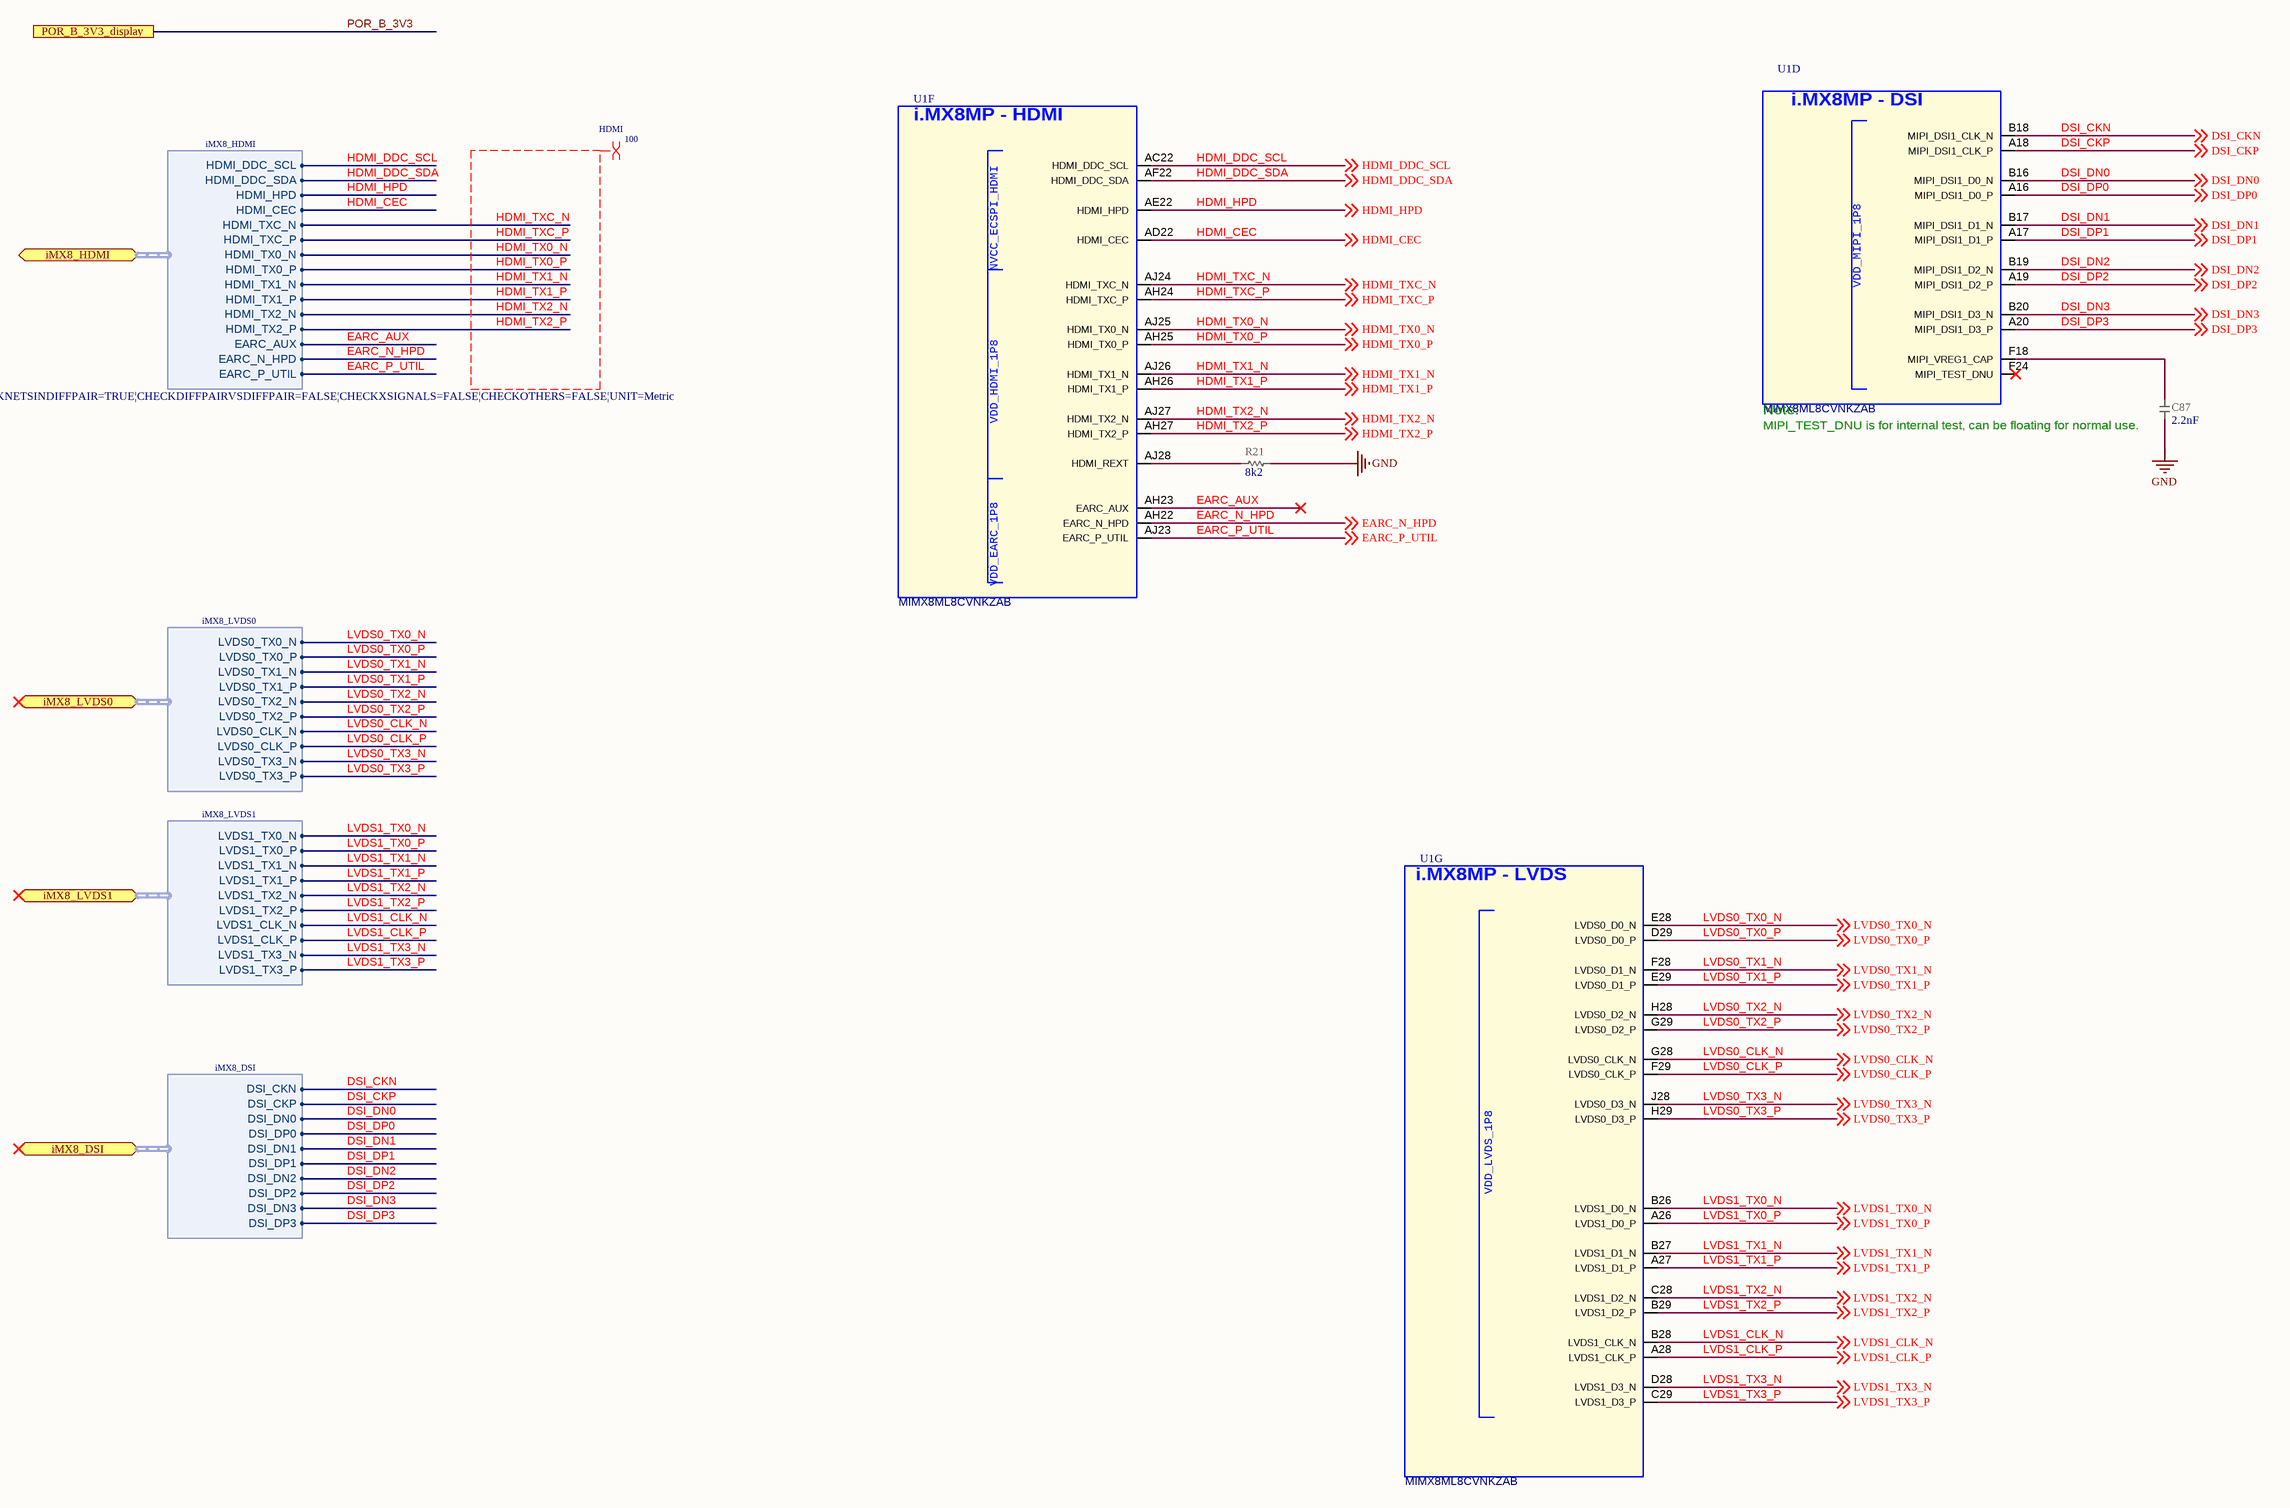
[diagram p4: IMX8_DISPLAY.SchDoc]

### Parts
C87  value 2.2nF  [CAP_0201_UN1Q]  (hidden comment: CAP_0201_2n2)
R21  value 8k2  [RES_0201_UN1Q]  (hidden comment: RES_0201_8k2)
U1  MIMX8ML8CVNKZAB  [BGA548C50P29X29_1500X1500X148]  (parts D,F,G of 15)

### Ports
iMX8_DSI (bidir, harness iMX8_DSI), iMX8_HDMI (bidir, harness iMX8_HDMI), iMX8_LVDS0 (bidir, harness iMX8_LVDS0), iMX8_LVDS1 (bidir, harness iMX8_LVDS1), POR_B_3V3_display

### Harnesses
iMX8_LVDS0: LVDS0_TX0_N, LVDS0_TX0_P, LVDS0_TX1_N, LVDS0_TX1_P, LVDS0_TX2_N, LVDS0_TX2_P, LVDS0_CLK_N, LVDS0_CLK_P, LVDS0_TX3_N, LVDS0_TX3_P
iMX8_LVDS1: LVDS1_TX0_N, LVDS1_TX0_P, LVDS1_TX1_N, LVDS1_TX1_P, LVDS1_TX2_N, LVDS1_TX2_P, LVDS1_CLK_N, LVDS1_CLK_P, LVDS1_TX3_N, LVDS1_TX3_P
iMX8_DSI: DSI_CKN, DSI_CKP, DSI_DN0, DSI_DP0, DSI_DN1, DSI_DP1, DSI_DN2, DSI_DP2, DSI_DN3, DSI_DP3
iMX8_HDMI: HDMI_DDC_SCL, HDMI_DDC_SDA, HDMI_HPD, HDMI_CEC, EARC_AUX, EARC_N_HPD, EARC_P_UTIL, HDMI_TXC_N, HDMI_TXC_P, HDMI_TX0_N, HDMI_TX0_P, HDMI_TX1_N, HDMI_TX1_P, HDMI_TX2_N, HDMI_TX2_P

### Nets
GND: C87.1 R21.2
DSI_CKN: U1.B18(MIPI_DSI1_CLK_N) ; off-sheet DSI_CKN, port iMX8_DSI.DSI_CKN
DSI_CKP: U1.A18(MIPI_DSI1_CLK_P) ; off-sheet DSI_CKP, port iMX8_DSI.DSI_CKP
DSI_DN0: U1.B16(MIPI_DSI1_D0_N) ; off-sheet DSI_DN0, port iMX8_DSI.DSI_DN0
DSI_DN1: U1.B17(MIPI_DSI1_D1_N) ; off-sheet DSI_DN1, port iMX8_DSI.DSI_DN1
DSI_DN2: U1.B19(MIPI_DSI1_D2_N) ; off-sheet DSI_DN2, port iMX8_DSI.DSI_DN2
DSI_DN3: U1.B20(MIPI_DSI1_D3_N) ; off-sheet DSI_DN3, port iMX8_DSI.DSI_DN3
DSI_DP0: U1.A16(MIPI_DSI1_D0_P) ; off-sheet DSI_DP0, port iMX8_DSI.DSI_DP0
DSI_DP1: U1.A17(MIPI_DSI1_D1_P) ; off-sheet DSI_DP1, port iMX8_DSI.DSI_DP1
DSI_DP2: U1.A19(MIPI_DSI1_D2_P) ; off-sheet DSI_DP2, port iMX8_DSI.DSI_DP2
DSI_DP3: U1.A20(MIPI_DSI1_D3_P) ; off-sheet DSI_DP3, port iMX8_DSI.DSI_DP3
EARC_AUX: U1.AH23(EARC_AUX) ; port iMX8_HDMI.EARC_AUX
EARC_N_HPD: U1.AH22(EARC_N_HPD) ; off-sheet EARC_N_HPD, port iMX8_HDMI.EARC_N_HPD
EARC_P_UTIL: U1.AJ23(EARC_P_UTIL) ; off-sheet EARC_P_UTIL, port iMX8_HDMI.EARC_P_UTIL
HDMI_CEC: U1.AD22(HDMI_CEC) ; off-sheet HDMI_CEC, port iMX8_HDMI.HDMI_CEC
HDMI_DDC_SCL: U1.AC22(HDMI_DDC_SCL) ; off-sheet HDMI_DDC_SCL, port iMX8_HDMI.HDMI_DDC_SCL
HDMI_DDC_SDA: U1.AF22(HDMI_DDC_SDA) ; off-sheet HDMI_DDC_SDA, port iMX8_HDMI.HDMI_DDC_SDA
HDMI_HPD: U1.AE22(HDMI_HPD) ; off-sheet HDMI_HPD, port iMX8_HDMI.HDMI_HPD
HDMI_TX0_N: U1.AJ25(HDMI_TX0_N) ; off-sheet HDMI_TX0_N, port iMX8_HDMI.HDMI_TX0_N
HDMI_TX0_P: U1.AH25(HDMI_TX0_P) ; off-sheet HDMI_TX0_P, port iMX8_HDMI.HDMI_TX0_P
HDMI_TX1_N: U1.AJ26(HDMI_TX1_N) ; off-sheet HDMI_TX1_N, port iMX8_HDMI.HDMI_TX1_N
HDMI_TX1_P: U1.AH26(HDMI_TX1_P) ; off-sheet HDMI_TX1_P, port iMX8_HDMI.HDMI_TX1_P
HDMI_TX2_N: U1.AJ27(HDMI_TX2_N) ; off-sheet HDMI_TX2_N, port iMX8_HDMI.HDMI_TX2_N
HDMI_TX2_P: U1.AH27(HDMI_TX2_P) ; off-sheet HDMI_TX2_P, port iMX8_HDMI.HDMI_TX2_P
HDMI_TXC_N: U1.AJ24(HDMI_TXC_N) ; off-sheet HDMI_TXC_N, port iMX8_HDMI.HDMI_TXC_N
HDMI_TXC_P: U1.AH24(HDMI_TXC_P) ; off-sheet HDMI_TXC_P, port iMX8_HDMI.HDMI_TXC_P
LVDS0_CLK_N: U1.G28(LVDS0_CLK_N) ; off-sheet LVDS0_CLK_N, port iMX8_LVDS0.LVDS0_CLK_N
LVDS0_CLK_P: U1.F29(LVDS0_CLK_P) ; off-sheet LVDS0_CLK_P, port iMX8_LVDS0.LVDS0_CLK_P
LVDS0_TX0_N: U1.E28(LVDS0_D0_N) ; off-sheet LVDS0_TX0_N, port iMX8_LVDS0.LVDS0_TX0_N
LVDS0_TX0_P: U1.D29(LVDS0_D0_P) ; off-sheet LVDS0_TX0_P, port iMX8_LVDS0.LVDS0_TX0_P
LVDS0_TX1_N: U1.F28(LVDS0_D1_N) ; off-sheet LVDS0_TX1_N, port iMX8_LVDS0.LVDS0_TX1_N
LVDS0_TX1_P: U1.E29(LVDS0_D1_P) ; off-sheet LVDS0_TX1_P, port iMX8_LVDS0.LVDS0_TX1_P
LVDS0_TX2_N: U1.H28(LVDS0_D2_N) ; off-sheet LVDS0_TX2_N, port iMX8_LVDS0.LVDS0_TX2_N
LVDS0_TX2_P: U1.G29(LVDS0_D2_P) ; off-sheet LVDS0_TX2_P, port iMX8_LVDS0.LVDS0_TX2_P
LVDS0_TX3_N: U1.J28(LVDS0_D3_N) ; off-sheet LVDS0_TX3_N, port iMX8_LVDS0.LVDS0_TX3_N
LVDS0_TX3_P: U1.H29(LVDS0_D3_P) ; off-sheet LVDS0_TX3_P, port iMX8_LVDS0.LVDS0_TX3_P
LVDS1_CLK_N: U1.B28(LVDS1_CLK_N) ; off-sheet LVDS1_CLK_N, port iMX8_LVDS1.LVDS1_CLK_N
LVDS1_CLK_P: U1.A28(LVDS1_CLK_P) ; off-sheet LVDS1_CLK_P, port iMX8_LVDS1.LVDS1_CLK_P
LVDS1_TX0_N: U1.B26(LVDS1_D0_N) ; off-sheet LVDS1_TX0_N, port iMX8_LVDS1.LVDS1_TX0_N
LVDS1_TX0_P: U1.A26(LVDS1_D0_P) ; off-sheet LVDS1_TX0_P, port iMX8_LVDS1.LVDS1_TX0_P
LVDS1_TX1_N: U1.B27(LVDS1_D1_N) ; off-sheet LVDS1_TX1_N, port iMX8_LVDS1.LVDS1_TX1_N
LVDS1_TX1_P: U1.A27(LVDS1_D1_P) ; off-sheet LVDS1_TX1_P, port iMX8_LVDS1.LVDS1_TX1_P
LVDS1_TX2_N: U1.C28(LVDS1_D2_N) ; off-sheet LVDS1_TX2_N, port iMX8_LVDS1.LVDS1_TX2_N
LVDS1_TX2_P: U1.B29(LVDS1_D2_P) ; off-sheet LVDS1_TX2_P, port iMX8_LVDS1.LVDS1_TX2_P
LVDS1_TX3_N: U1.D28(LVDS1_D3_N) ; off-sheet LVDS1_TX3_N, port iMX8_LVDS1.LVDS1_TX3_N
LVDS1_TX3_P: U1.C29(LVDS1_D3_P) ; off-sheet LVDS1_TX3_P, port iMX8_LVDS1.LVDS1_TX3_P
POR_B_3V3: port POR_B_3V3_display
NetC87_2: C87.2 U1.F18(MIPI_VREG1_CAP)
NetR21_1: R21.1 U1.AJ28(HDMI_REXT)

Not connected (* = marked no-connect by the designer): U1 F24(MIPI_TEST_DNU)*

### Layout directives
differential pair; net class HDMI; rule Matched Net Lengths [Tolerance = 0.1mm]; differential pair class 100: HDMI_TX0_N, HDMI_TX0_P, HDMI_TX1_N, HDMI_TX1_P, HDMI_TX2_N, HDMI_TX2_P, HDMI_TXC_N, HDMI_TXC_P

### Notes on the sheet
- Note:
- (near C87) MIPI_TEST_DNU is for internal test, can be floating for normal use.
- DWG NO:
- REV:
- THIS DOCUMENT AND THE DATA DISCLOSED HEREIN OR
- HEREWITH IS THE PROPERTY OF ALTIUM LIMITED AND MAY
- BE FREELY DISTRIBUTED IN WHOLE. NO RIGHTS ARE
- RESERVED OR EXPRESS OR IMPLIED WARANTEE GIVEN.
- REVISION
- DESCRIPTION
- DATE
- APPROVED
- ENG:
- APPROVALS
- PROJECT
- DSN:
- CHK:
- REFERENCE DOCUMENTS
- PROJECT REVISION:
- TITLE
- DOCUMENT REVISION:
- DESIGN ITEM:
- BOM:
- FAB DWG:
- PCB DWG:
- ASSY DWG:
- SCALE:
- A2
- SIZE
- CAGE CODE
- FILE NAME
- DWG NO.
- SHEET
- OF
- REV
- (in symbol CMP-001-000983-8, part D) i.MX8MP - DSI
- (in symbol CMP-001-000983-8, part F) i.MX8MP - HDMI
- (in symbol CMP-001-000983-8, part G) i.MX8MP - LVDS

### Library data of the parts
C87 = CMP-001-000281-14: CAP; Part Number: GRM033R71E222KA12J; Manufacturer: Murata; Temperature characteristics: X7R; Tolerance: +/-10%; Sort order: 302; HasBeenBuilt: TBD; Alternative component: Allowed; Voltage: 25V; System: RLC; Package: 0201; ComponentLink1Description: 1_Datasheet; ComponentLink2Description: 2_Product page; ComponentLink3Description: 3_X-information; ComponentLink4Description: 4_X-information; Creation date: 20222504; ClassName: SMALL; Source: RLC_UN1Q.SchLib; Manufacturer Part Number: GRM033R71E222KA12J; Component Type: Capacitor
R21 = CMP-001-001255-9: RES; Part Number: ERJ1GNF8201C; Manufacturer: Panasonic Electronic Components; Tolerance: 1%; Power Rating: 1/20W; Sort order: 322; Alternative component: Allowed; System: RLC; Package: 0201; ClassName: SMALL; ComponentLink1Description: 1_Datasheet; ComponentLink2Description: 2_Product page; ComponentLink3Description: 3_X-information; ComponentLink4Description: 4_X-information; Creation date: 20240404; Component Type: Resistor
U1 = CMP-001-000983-8: CPU QUAD CORTEX A53+M4 1.6GHZ BGA548 Industrial; Manufacturer: NXP Semiconductors; Sort order: 501; System: IC; ComponentLink1Description: 1_Datasheet; ComponentLink1URL: https://www.nxp.com/part/MIMX8ML8CVNKZAB#/; ComponentLink2Description: 2_Product page; ComponentLink3Description: 3_X-information; ComponentLink4Description: 4_X-information; Creation date: 20240524; Dimensions WxLxH: 15 x 15 x 1.33mm; Operating temperature range: -40... +105 °C; Package: FCBGA548; Part Number: MIMX8ML8CVNKZAB; ClassName: BIG; Source: UUDET_KOMPONENTIT.SchLib; Design Item ID: MIMX8ML8CVNKZAB; Manufacturer Part Number: MIMX8ML8CVNKZAB; Component Type: Processor

## Sheet IMX8_eMMC.SchDoc
size 594 x 420 mm; SheetNumber: 10; SheetTotal: 12
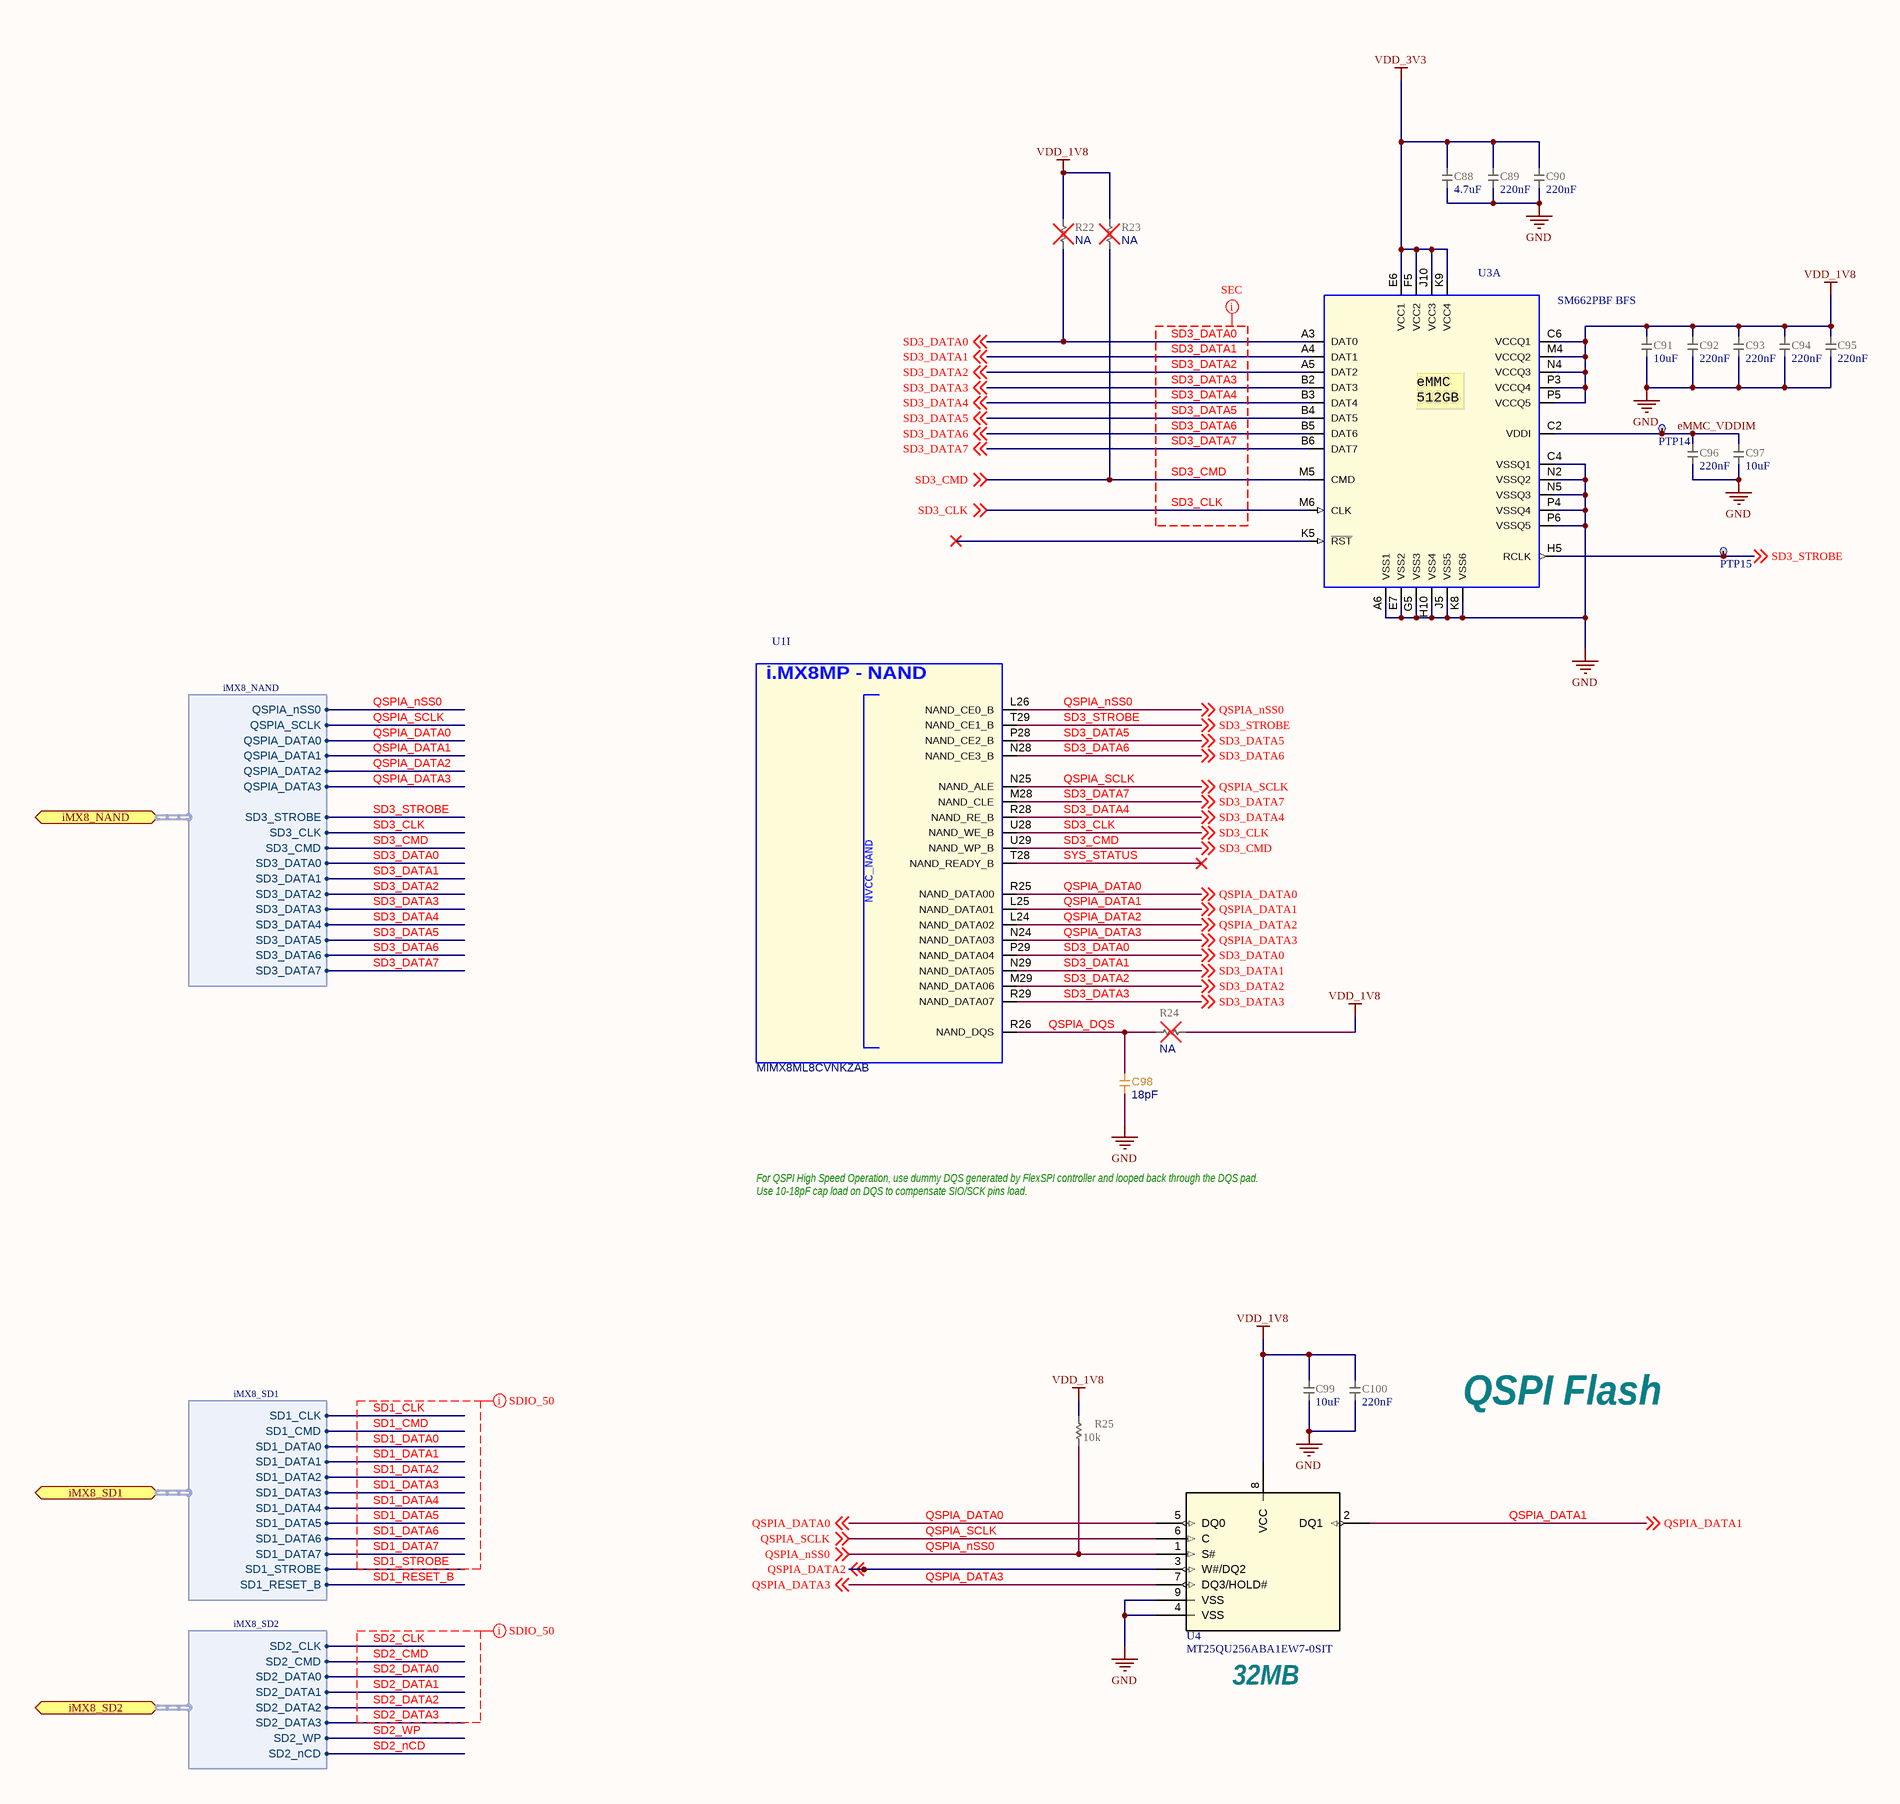
[diagram p5: IMX8_eMMC.SchDoc, left]
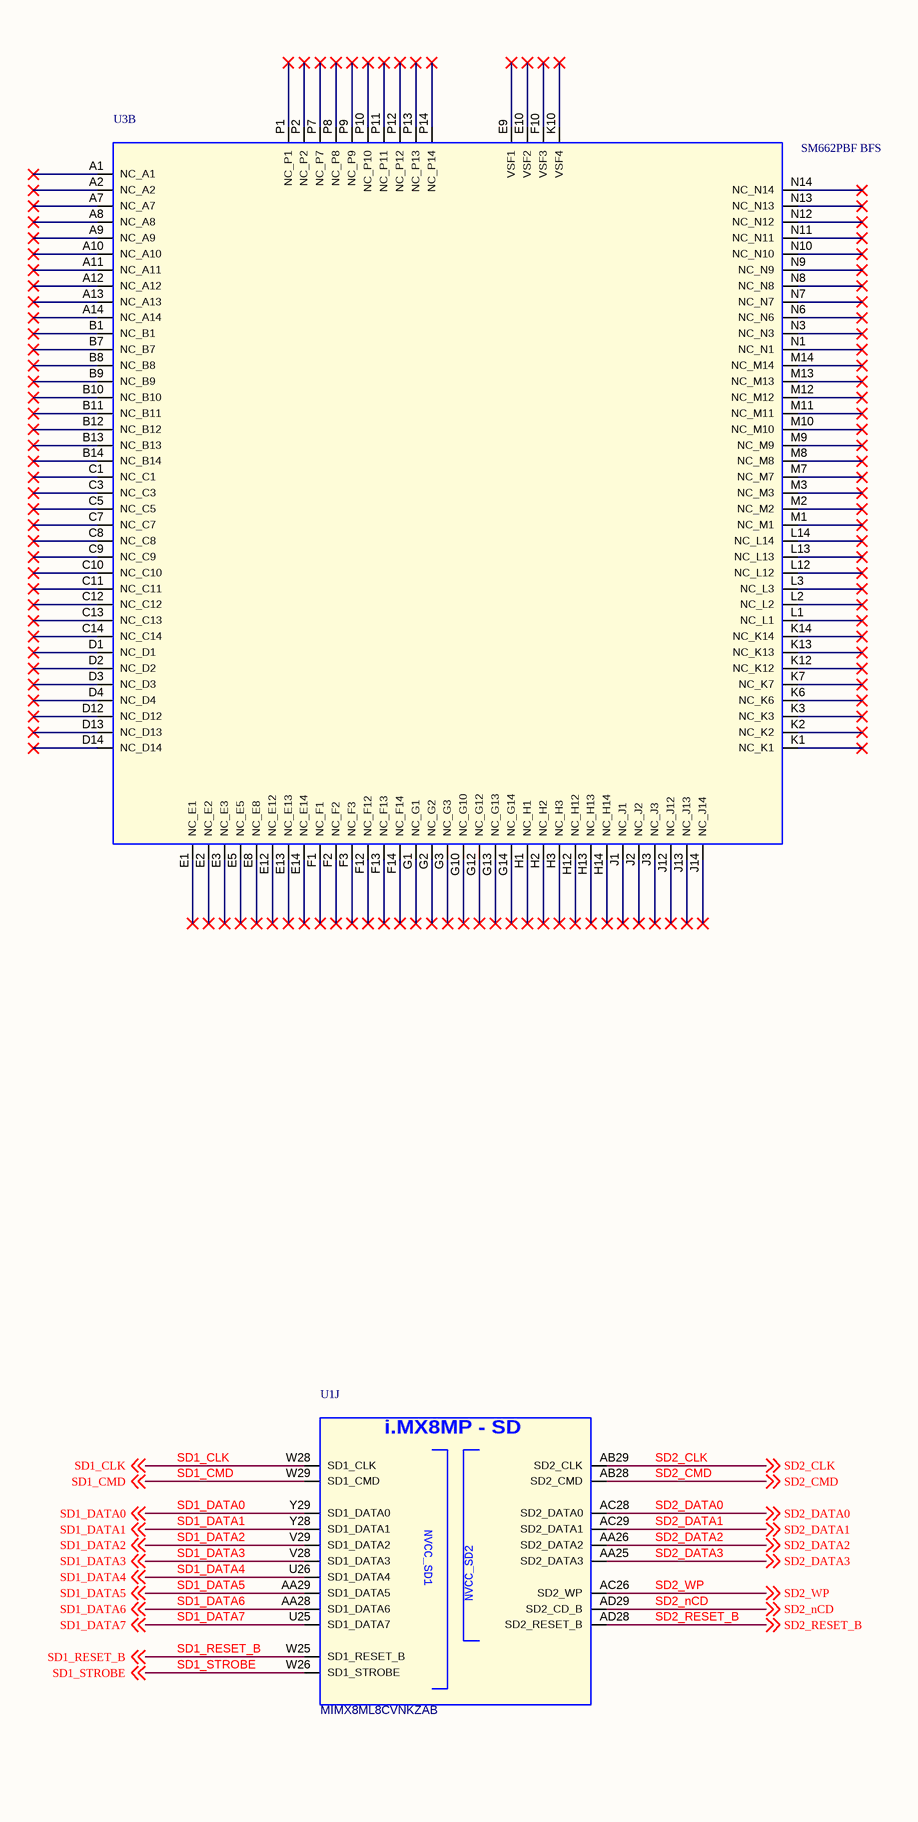
[diagram p6: IMX8_eMMC.SchDoc, right]

### Parts
C88  value 4.7uF  [CAP_0402_H09W07_UN1Q]  (hidden comment: CAP_0402_4u7_10V_X6S)
C89  value 220nF  [CAP_0201_UN1Q]  (hidden comment: CAP_0201_220n_10V_X6S)
C90  value 220nF  [CAP_0201_UN1Q]  (hidden comment: CAP_0201_220n_10V_X6S)
C91  value 10uF  [CAP_0402_H09W07_UN1Q]  (hidden comment: CAP_0402_10u_X6S)
C92  value 220nF  [CAP_0201_UN1Q]  (hidden comment: CAP_0201_220n_10V_X6S)
C93  value 220nF  [CAP_0201_UN1Q]  (hidden comment: CAP_0201_220n_10V_X6S)
C94  value 220nF  [CAP_0201_UN1Q]  (hidden comment: CAP_0201_220n_10V_X6S)
C95  value 220nF  [CAP_0201_UN1Q]  (hidden comment: CAP_0201_220n_10V_X6S)
C96  value 220nF  [CAP_0201_UN1Q]  (hidden comment: CAP_0201_220n_10V_X6S)
C97  value 10uF  [CAP_0402_H09W07_UN1Q]  (hidden comment: CAP_0402_10u_X6S)
C98  value 18pF  [CAP_0201_UN1Q]  (hidden comment: CAP_0201_18p_RF_MATCHING)
C99  value 10uF  [CAP_0402_H09W07_UN1Q]  (hidden comment: CAP_0402_10u_X6S)
C100  value 220nF  [CAP_0201_UN1Q]  (hidden comment: CAP_0201_220n_10V_X6S)
PTP14  PTP_0.4mm  [PTP_0.4mm]  (value not drawn)  (no BOM)
PTP15  PTP_0.4mm  [PTP_0.4mm]  (value not drawn)  (no BOM)
R22  value NA  [RES_0201_UN1Q]  (hidden comment: RES_0201_NA)
R23  value NA  [RES_0201_UN1Q]  (hidden comment: RES_0201_NA)
R24  value NA  [RES_0201_UN1Q]  (hidden comment: RES_0201_NA)
R25  10k  [RES_0201_UN1Q]
U1  MIMX8ML8CVNKZAB  [BGA548C50P29X29_1500X1500X148]  (parts I,J of 15)
U3  SM662PBF BFS  [GA153C50P14X14_1150X1300X120]  (parts A,B of 2)
U4  MT25QU256ABA1EW7-0SIT  [W-PDFN-8MLP8_W7_MRN]

### Ports
iMX8_NAND (bidir, harness iMX8_NAND), iMX8_SD1 (bidir, harness iMX8_SD1), iMX8_SD2 (bidir, harness iMX8_SD2)

### Harnesses
iMX8_SD1: SD1_CLK, SD1_CMD, SD1_DATA0, SD1_DATA1, SD1_DATA2, SD1_DATA3, SD1_DATA4, SD1_DATA5, SD1_DATA6, SD1_DATA7, SD1_RESET_B, SD1_STROBE
iMX8_SD2: SD2_CLK, SD2_CMD, SD2_DATA0, SD2_DATA1, SD2_DATA2, SD2_DATA3, SD2_WP, SD2_nCD
iMX8_NAND: QSPIA_SCLK, QSPIA_DATA0, QSPIA_nSS0, QSPIA_DATA1, QSPIA_DATA2, QSPIA_DATA3, SD3_STROBE, SD3_CLK, SD3_CMD, SD3_DATA0, SD3_DATA1, SD3_DATA2, SD3_DATA3, SD3_DATA4, SD3_DATA5, SD3_DATA6, SD3_DATA7

### Nets
GND: C88.1 C89.1 C90.1 C91.2 C92.1 C93.1 C94.1 C95.1 C96.1 C97.2 C98.1 C99.2 C100.2 U3.A6(VSS1) U3.C4(VSSQ1) U3.E7(VSS2) U3.G5(VSS3) U3.H10(VSS4) U3.J5(VSS5) U3.K8(VSS6) U3.N2(VSSQ2) U3.N5(VSSQ3) U3.P4(VSSQ4) U3.P6(VSSQ5) U4.4(VSS) U4.9(VSS)
VDD_1V8: C91.1 C92.2 C93.2 C94.2 C95.2 C99.1 C100.1 R22.2 R23.2 R24.2 R25.2 U3.C6(VCCQ1) U3.M4(VCCQ2) U3.N4(VCCQ3) U3.P3(VCCQ4) U3.P5(VCCQ5) U4.8(VCC)
VDD_3V3: C88.2 C89.2 C90.2 U3.E6(VCC1) U3.F5(VCC2) U3.J10(VCC3) U3.K9(VCC4)
eMMC_VDDIM: C96.2 C97.1 PTP14.1(TP) U3.C2(VDDI)
QSPIA_DATA0: U1.R25(NAND_DATA00) U4.5(DQ0) ; off-sheet QSPIA_DATA0, port iMX8_NAND.QSPIA_DATA0
QSPIA_DATA1: U1.L25(NAND_DATA01) U4.2(DQ1) ; off-sheet QSPIA_DATA1, port iMX8_NAND.QSPIA_DATA1
QSPIA_DATA2: U1.L24(NAND_DATA02) U4.3(W#/DQ2) ; off-sheet QSPIA_DATA2, port iMX8_NAND.QSPIA_DATA2
QSPIA_DATA3: U1.N24(NAND_DATA03) U4.7(DQ3/HOLD#) ; off-sheet QSPIA_DATA3, port iMX8_NAND.QSPIA_DATA3
QSPIA_DQS: C98.2 R24.1 U1.R26(NAND_DQS)
QSPIA_nSS0: R25.1 U1.L26(NAND_CE0_B) U4.1(S#) ; off-sheet QSPIA_nSS0, port iMX8_NAND.QSPIA_nSS0
QSPIA_SCLK: U1.N25(NAND_ALE) U4.6(C) ; off-sheet QSPIA_SCLK, port iMX8_NAND.QSPIA_SCLK
SD1_CLK: U1.W28(SD1_CLK) ; off-sheet SD1_CLK, port iMX8_SD1.SD1_CLK
SD1_CMD: U1.W29(SD1_CMD) ; off-sheet SD1_CMD, port iMX8_SD1.SD1_CMD
SD1_DATA0: U1.Y29(SD1_DATA0) ; off-sheet SD1_DATA0, port iMX8_SD1.SD1_DATA0
SD1_DATA1: U1.Y28(SD1_DATA1) ; off-sheet SD1_DATA1, port iMX8_SD1.SD1_DATA1
SD1_DATA2: U1.V29(SD1_DATA2) ; off-sheet SD1_DATA2, port iMX8_SD1.SD1_DATA2
SD1_DATA3: U1.V28(SD1_DATA3) ; off-sheet SD1_DATA3, port iMX8_SD1.SD1_DATA3
SD1_DATA4: U1.U26(SD1_DATA4) ; off-sheet SD1_DATA4, port iMX8_SD1.SD1_DATA4
SD1_DATA5: U1.AA29(SD1_DATA5) ; off-sheet SD1_DATA5, port iMX8_SD1.SD1_DATA5
SD1_DATA6: U1.AA28(SD1_DATA6) ; off-sheet SD1_DATA6, port iMX8_SD1.SD1_DATA6
SD1_DATA7: U1.U25(SD1_DATA7) ; off-sheet SD1_DATA7, port iMX8_SD1.SD1_DATA7
SD1_RESET_B: U1.W25(SD1_RESET_B) ; off-sheet SD1_RESET_B, port iMX8_SD1.SD1_RESET_B
SD1_STROBE: U1.W26(SD1_STROBE) ; off-sheet SD1_STROBE, port iMX8_SD1.SD1_STROBE
SD2_CLK: U1.AB29(SD2_CLK) ; off-sheet SD2_CLK, port iMX8_SD2.SD2_CLK
SD2_CMD: U1.AB28(SD2_CMD) ; off-sheet SD2_CMD, port iMX8_SD2.SD2_CMD
SD2_DATA0: U1.AC28(SD2_DATA0) ; off-sheet SD2_DATA0, port iMX8_SD2.SD2_DATA0
SD2_DATA1: U1.AC29(SD2_DATA1) ; off-sheet SD2_DATA1, port iMX8_SD2.SD2_DATA1
SD2_DATA2: U1.AA26(SD2_DATA2) ; off-sheet SD2_DATA2, port iMX8_SD2.SD2_DATA2
SD2_DATA3: U1.AA25(SD2_DATA3) ; off-sheet SD2_DATA3, port iMX8_SD2.SD2_DATA3
SD2_nCD: U1.AD29(SD2_CD_B) ; off-sheet SD2_nCD, port iMX8_SD2.SD2_nCD
SD2_RESET_B: U1.AD28(SD2_RESET_B) ; off-sheet SD2_RESET_B
SD2_WP: U1.AC26(SD2_WP) ; off-sheet SD2_WP, port iMX8_SD2.SD2_WP
SD3_CLK: U1.U28(NAND_WE_B) U3.M6(CLK) ; off-sheet SD3_CLK, port iMX8_NAND.SD3_CLK
SD3_CMD: R23.1 U1.U29(NAND_WP_B) U3.M5(CMD) ; off-sheet SD3_CMD, port iMX8_NAND.SD3_CMD
SD3_DATA0: R22.1 U1.P29(NAND_DATA04) U3.A3(DAT0) ; off-sheet SD3_DATA0, port iMX8_NAND.SD3_DATA0
SD3_DATA1: U1.N29(NAND_DATA05) U3.A4(DAT1) ; off-sheet SD3_DATA1, port iMX8_NAND.SD3_DATA1
SD3_DATA2: U1.M29(NAND_DATA06) U3.A5(DAT2) ; off-sheet SD3_DATA2, port iMX8_NAND.SD3_DATA2
SD3_DATA3: U1.R29(NAND_DATA07) U3.B2(DAT3) ; off-sheet SD3_DATA3, port iMX8_NAND.SD3_DATA3
SD3_DATA4: U1.R28(NAND_RE_B) U3.B3(DAT4) ; off-sheet SD3_DATA4, port iMX8_NAND.SD3_DATA4
SD3_DATA5: U1.P28(NAND_CE2_B) U3.B4(DAT5) ; off-sheet SD3_DATA5, port iMX8_NAND.SD3_DATA5
SD3_DATA6: U1.N28(NAND_CE3_B) U3.B5(DAT6) ; off-sheet SD3_DATA6, port iMX8_NAND.SD3_DATA6
SD3_DATA7: U1.M28(NAND_CLE) U3.B6(DAT7) ; off-sheet SD3_DATA7, port iMX8_NAND.SD3_DATA7
SD3_STROBE: PTP15.1(TP) U1.T29(NAND_CE1_B) U3.H5(RCLK) ; off-sheet SD3_STROBE, port iMX8_NAND.SD3_STROBE
SYS_STATUS: U1.T28(NAND_READY_B)

Not connected (* = marked no-connect by the designer): U3 A1(NC_A1)* A2(NC_A2)* A7(NC_A7)* A8(NC_A8)* A9(NC_A9)* A10(NC_A10)* A11(NC_A11)* A12(NC_A12)* A13(NC_A13)* A14(NC_A14)* B1(NC_B1)* B7(NC_B7)* B8(NC_B8)* B9(NC_B9)* B10(NC_B10)* B11(NC_B11)* B12(NC_B12)* B13(NC_B13)* B14(NC_B14)* C1(NC_C1)* C3(NC_C3)* C5(NC_C5)* C7(NC_C7)* C8(NC_C8)* C9(NC_C9)* C10(NC_C10)* C11(NC_C11)* C12(NC_C12)* C13(NC_C13)* C14(NC_C14)* D1(NC_D1)* D2(NC_D2)* D3(NC_D3)* D4(NC_D4)* D12(NC_D12)* D13(NC_D13)* D14(NC_D14)* E1(NC_E1)* E2(NC_E2)* E3(NC_E3)* E5(NC_E5)* E8(NC_E8)* E9(VSF1)* E10(VSF2)* E12(NC_E12)* E13(NC_E13)* E14(NC_E14)* F1(NC_F1)* F2(NC_F2)* F3(NC_F3)* F10(VSF3)* F12(NC_F12)* F13(NC_F13)* F14(NC_F14)* G1(NC_G1)* G2(NC_G2)* G3(NC_G3)* G10(NC_G10)* G12(NC_G12)* G13(NC_G13)* G14(NC_G14)* H1(NC_H1)* H2(NC_H2)* H3(NC_H3)* H12(NC_H12)* H13(NC_H13)* H14(NC_H14)* J1(NC_J1)* J2(NC_J2)* J3(NC_J3)* J12(NC_J12)* J13(NC_J13)* J14(NC_J14)* K1(NC_K1)* K2(NC_K2)* K3(NC_K3)* K5(~{RST})* K6(NC_K6)* K7(NC_K7)* K10(VSF4)* K12(NC_K12)* K13(NC_K13)* K14(NC_K14)* L1(NC_L1)* L2(NC_L2)* L3(NC_L3)* L12(NC_L12)* L13(NC_L13)* L14(NC_L14)* M1(NC_M1)* M2(NC_M2)* M3(NC_M3)* M7(NC_M7)* M8(NC_M8)* M9(NC_M9)* M10(NC_M10)* M11(NC_M11)* M12(NC_M12)* M13(NC_M13)* M14(NC_M14)* N1(NC_N1)* N3(NC_N3)* N6(NC_N6)* N7(NC_N7)* N8(NC_N8)* N9(NC_N9)* N10(NC_N10)* N11(NC_N11)* N12(NC_N12)* N13(NC_N13)* N14(NC_N14)* P1(NC_P1)* P2(NC_P2)* P7(NC_P7)* P8(NC_P8)* P9(NC_P9)* P10(NC_P10)* P11(NC_P11)* P12(NC_P12)* P13(NC_P13)* P14(NC_P14)*

### Layout directives
net class SEC: SD3_CLK, SD3_CMD, SD3_DATA0, SD3_DATA1, SD3_DATA2, SD3_DATA3, SD3_DATA4, SD3_DATA5, SD3_DATA6, SD3_DATA7
net class SDIO: SD1_CLK, SD1_CMD, SD1_DATA0, SD1_DATA1, SD1_DATA2, SD1_DATA3, SD1_DATA4, SD1_DATA5, SD1_DATA6, SD1_DATA7, SD1_STROBE, SD2_CLK, SD2_CMD, SD2_DATA0, SD2_DATA1, SD2_DATA2, SD2_DATA3

### Notes on the sheet
- For QSPI High Speed Operation, use dummy DQS generated by FlexSPI controller and looped back through the DQS pad.
  Use 10-18pF cap load on DQS to compensate SIO/SCK pins load.
- QSPI Flash
- (near U4) 32MB
- DWG NO:
- REV:
- THIS DOCUMENT AND THE DATA DISCLOSED HEREIN OR
- HEREWITH IS THE PROPERTY OF ALTIUM LIMITED AND MAY
- BE FREELY DISTRIBUTED IN WHOLE. NO RIGHTS ARE
- RESERVED OR EXPRESS OR IMPLIED WARANTEE GIVEN.
- REVISION
- DESCRIPTION
- DATE
- APPROVED
- ENG:
- APPROVALS
- PROJECT
- DSN:
- CHK:
- REFERENCE DOCUMENTS
- PROJECT REVISION:
- TITLE
- DOCUMENT REVISION:
- DESIGN ITEM:
- BOM:
- FAB DWG:
- PCB DWG:
- ASSY DWG:
- SCALE:
- A2
- SIZE
- CAGE CODE
- FILE NAME
- DWG NO.
- SHEET
- OF
- REV
- (in symbol CMP-001-000983-8, part I) i.MX8MP - NAND
- (in symbol CMP-001-000983-8, part J) i.MX8MP - SD
- (in symbol CMP-001-001175-2, part A) eMMC / 512GB

### Library data of the parts
C88 = CMP-001-000888-12: CAP; Part Number: GRT155C81A475ME13J; Manufacturer: Murata; Sort order: 304; HasBeenBuilt: TBD; Alternative component: Allowed; System: RLC; Voltage: 10V; Temperature characteristics: X6S; Tolerance: +/-10%; ComponentLink2Description: 2_Product page; Package: 0402; Creation date: 26042024; ComponentLink1Description: 1_Datasheet; ComponentLink3Description: 3_X-information; ComponentLink4Description: 4_X-information; Manufacturer Part Number: GRT155C81A475ME13J; Component Type: Capacitor
C89 C90 C92-C96 C100 = CMP-001-000889-11: CAP; Part Number: GRM033C81A224KE01D; Manufacturer: Murata; Temperature characteristics: X6S; Voltage: 10V; Tolerance: +/-20%; Sort order: 302; HasBeenBuilt: TBD; Alternative component: Allowed; System: RLC; Package: 0201; Dimensions WxLxH: 0.35; ComponentLink1Description: 1_Datasheet; ComponentLink2Description: 2_Product page; ComponentLink3Description: 3_X-information; ComponentLink4Description: 4_X-information; Creation date: 26042024; ClassName: SMALL; Manufacturer Part Number: GRM033C81A224KE01D; Component Type: Capacitor
C91 C97 C99 = CMP-001-000883-14: CAP; Part Number: GMC04X6S106M6R3NT; Manufacturer: Cal-Chip Electronics; Voltage: 6.3V; Tolerance: +/-20%; Temperature characteristics: X6S; Sort order: 304; HasBeenBuilt: TBD; Alternative component: Allowed; System: RLC; Package: 0402; ComponentLink1Description: 1_Datasheet; ComponentLink2Description: 2_Product page; ComponentLink3Description: 3_X-information; ComponentLink4Description: 4_X-information; Creation date: 26042024; Manufacturer Part Number: GMC04X6S106M6R3NT; Component Type: Capacitor
C98 = CMP-001-000400-12: CAP_RF_MATCHING; Part Number: GJM0335C1E180JB01; Manufacturer: Murata; Voltage: 25V; Tolerance: +/-2%; Temperature characteristics: C0G; Remark: RF matching, use part number; Sort order: 202; HasBeenBuilt: TBD; System: RLC; Package: 0201; ClassName: SMALL; ComponentLink1Description: 1_Datasheet; ComponentLink2Description: 2_Product page; ComponentLink3Description: 3_X-information; ComponentLink4Description: 4_X-information; Creation date: 20200101; Source: RLC_UN1Q.SchLib; Manufacturer Part Number: GJM0335C1E180JB01; Component Type: Capacitor
PTP14 PTP15 = CMP-001-001296-3: Production Testpoint 0.4mm. Flying probe. Use 1mm pitch.; Part Number: PTP 0.4mm; ComponentLink4Description: 4_X-information; ComponentLink1Description: 1_Datasheet; Sort order: -; ClassName: SMALL; System: Test Point; HasBeenBuilt: -; Design Item ID: PTP_0.4mm; ComponentLink3Description: 3_X-information; Creation date: 20240909; ComponentLink2Description: 2_Product page; Component Type: Test Point
R22-R24 = CMP-001-000434-10: Not Assembled - RES; Sort order: 999; HasBeenBuilt: TBD; System: RLC; Package: 0201; ClassName: SMALL; ComponentLink1Description: 1_Datasheet; ComponentLink2Description: 2_Product page; ComponentLink3Description: 3_X-information; ComponentLink4Description: 4_X-information; Creation date: 20190101; Source: RLC_UN1Q.SchLib; Component Type: Resistor
R25 = RES_0201_10k: RES; Tolerance: +/-1%; Desc2: resistance_10K_1%_1/20W; Power Rating: 1/20W; Sort order: 322; HasBeenBuilt: TBD; HasBeenChecked: None; System: RLC; Value: 10k; Package: 0201; ClassName: SMALL; ComponentLink1Description: 1_Datasheet; ComponentLink2Description: 2_Product_page; ComponentLink3Description: 3_X-information; ComponentLink4Description: 4_X-information; Creation date: 20190101
U1 = CMP-001-000983-8: as U1 on sheet IMX8_DISPLAY; ComponentLink1Description: 1_Datasheet; ComponentLink1URL: https://www.nxp.com/part/MIMX8ML8CVNKZAB#/; ComponentLink2Description: 2_Product page; ComponentLink3Description: 3_X-information; ComponentLink4Description: 4_X-information; Creation date: 20240524; Dimensions WxLxH: 15 x 15 x 1.33mm; Operating temperature range: -40... +105 °C; Package: FCBGA548; Part Number: MIMX8ML8CVNKZAB; ClassName: BIG; Source: UUDET_KOMPONENTIT.SchLib; Design Item ID: MIMX8ML8CVNKZAB; Manufacturer Part Number: MIMX8ML8CVNKZAB; Component Type: Processor
U3 = CMP-001-001175-2: MEM NAND FLASH 512GB eMMC 5.1 HS400 2.7-3.6V, 1.8V VCCQ, TFBGA153 Ferri-eMMC Automotive; Manufacturer: Silicon Motion; Manufacturer Part Number: SM662PBFBFSS; Sort order: 511; System: IC; ComponentLink1Description: 1_Datasheet; ComponentLink2Description: 2_Product page; ComponentLink2URL: https://www.siliconmotion.com/products/Ferri-eMMC/detail; ComponentLink3Description: 3_Product brief; ComponentLink3URL: https://www.siliconmotion.com/download/DWo5/a/Ferri-eMMC_PB_EN.pdf; ComponentLink4Description: 4_X-information; Creation Date: 20250508; Dimensions WxLxH: 11.5 x 13 x 1.2 mm; Operating temperature range: -40 .... +105 °C; Package: TFBGA-153; Part Number: SM662PBF BFS; Component Type: Memory
U4 = MT25QU256ABA1EW7-0SIT: Description; Manufacturer_Name: Micron; Copyright: Copyright (C) 2025 Ultra Librarian. All rights reserved.; Manufacturer_Part_Number: MT25QU256ABA1EW7-0SIT; RefDes: RefDes; Type: Type

## Sheet IMX8_INPUT.SchDoc
size 594 x 420 mm; SheetNumber: 9; SheetTotal: 12
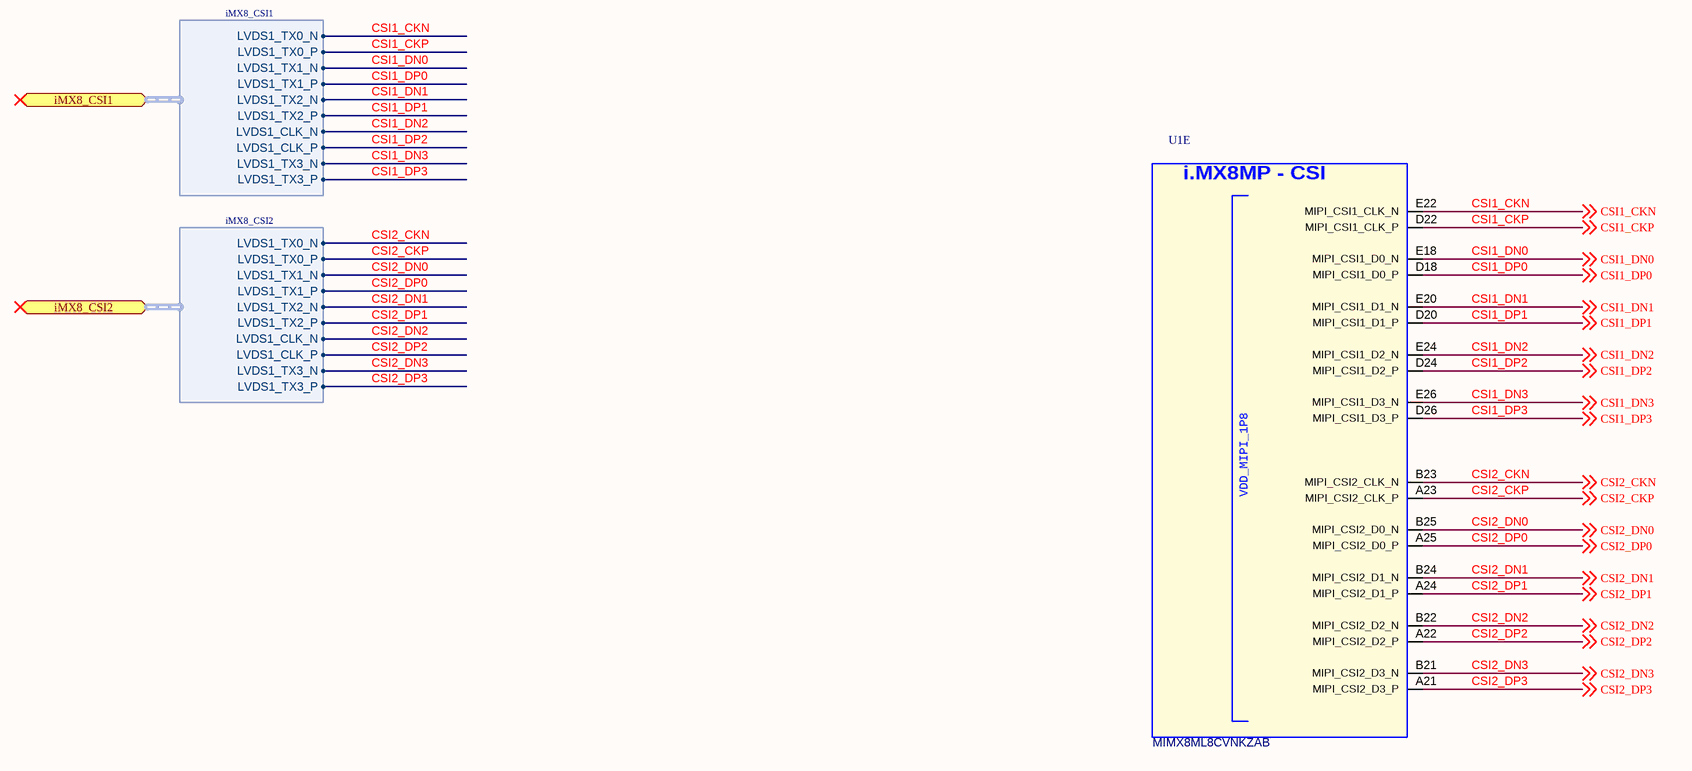
[diagram p7: IMX8_INPUT.SchDoc]

### Parts
U1  MIMX8ML8CVNKZAB  [BGA548C50P29X29_1500X1500X148]  (part E of 15)

### Ports
iMX8_CSI1 (bidir, harness iMX8_CSI1), iMX8_CSI2 (bidir, harness iMX8_CSI2)

### Harnesses
iMX8_CSI1: LVDS1_TX0_N, LVDS1_TX0_P, LVDS1_TX1_N, LVDS1_TX1_P, LVDS1_TX2_N, LVDS1_TX2_P, LVDS1_CLK_N, LVDS1_CLK_P, LVDS1_TX3_N, LVDS1_TX3_P
iMX8_CSI2: LVDS1_TX0_N, LVDS1_TX0_P, LVDS1_TX1_N, LVDS1_TX1_P, LVDS1_TX2_N, LVDS1_TX2_P, LVDS1_CLK_N, LVDS1_CLK_P, LVDS1_TX3_N, LVDS1_TX3_P

### Nets
CSI1_CKN: U1.E22(MIPI_CSI1_CLK_N) ; off-sheet CSI1_CKN, port iMX8_CSI1.LVDS1_TX0_N
CSI1_CKP: U1.D22(MIPI_CSI1_CLK_P) ; off-sheet CSI1_CKP, port iMX8_CSI1.LVDS1_TX0_P
CSI1_DN0: U1.E18(MIPI_CSI1_D0_N) ; off-sheet CSI1_DN0, port iMX8_CSI1.LVDS1_TX1_N
CSI1_DN1: U1.E20(MIPI_CSI1_D1_N) ; off-sheet CSI1_DN1, port iMX8_CSI1.LVDS1_TX2_N
CSI1_DN2: U1.E24(MIPI_CSI1_D2_N) ; off-sheet CSI1_DN2, port iMX8_CSI1.LVDS1_CLK_N
CSI1_DN3: U1.E26(MIPI_CSI1_D3_N) ; off-sheet CSI1_DN3, port iMX8_CSI1.LVDS1_TX3_N
CSI1_DP0: U1.D18(MIPI_CSI1_D0_P) ; off-sheet CSI1_DP0, port iMX8_CSI1.LVDS1_TX1_P
CSI1_DP1: U1.D20(MIPI_CSI1_D1_P) ; off-sheet CSI1_DP1, port iMX8_CSI1.LVDS1_TX2_P
CSI1_DP2: U1.D24(MIPI_CSI1_D2_P) ; off-sheet CSI1_DP2, port iMX8_CSI1.LVDS1_CLK_P
CSI1_DP3: U1.D26(MIPI_CSI1_D3_P) ; off-sheet CSI1_DP3, port iMX8_CSI1.LVDS1_TX3_P
CSI2_CKN: U1.B23(MIPI_CSI2_CLK_N) ; off-sheet CSI2_CKN, port iMX8_CSI2.LVDS1_TX0_N
CSI2_CKP: U1.A23(MIPI_CSI2_CLK_P) ; off-sheet CSI2_CKP, port iMX8_CSI2.LVDS1_TX0_P
CSI2_DN0: U1.B25(MIPI_CSI2_D0_N) ; off-sheet CSI2_DN0, port iMX8_CSI2.LVDS1_TX1_N
CSI2_DN1: U1.B24(MIPI_CSI2_D1_N) ; off-sheet CSI2_DN1, port iMX8_CSI2.LVDS1_TX2_N
CSI2_DN2: U1.B22(MIPI_CSI2_D2_N) ; off-sheet CSI2_DN2, port iMX8_CSI2.LVDS1_CLK_N
CSI2_DN3: U1.B21(MIPI_CSI2_D3_N) ; off-sheet CSI2_DN3, port iMX8_CSI2.LVDS1_TX3_N
CSI2_DP0: U1.A25(MIPI_CSI2_D0_P) ; off-sheet CSI2_DP0, port iMX8_CSI2.LVDS1_TX1_P
CSI2_DP1: U1.A24(MIPI_CSI2_D1_P) ; off-sheet CSI2_DP1, port iMX8_CSI2.LVDS1_TX2_P
CSI2_DP2: U1.A22(MIPI_CSI2_D2_P) ; off-sheet CSI2_DP2, port iMX8_CSI2.LVDS1_CLK_P
CSI2_DP3: U1.A21(MIPI_CSI2_D3_P) ; off-sheet CSI2_DP3, port iMX8_CSI2.LVDS1_TX3_P

### Notes on the sheet
- DWG NO:
- REV:
- THIS DOCUMENT AND THE DATA DISCLOSED HEREIN OR
- HEREWITH IS THE PROPERTY OF ALTIUM LIMITED AND MAY
- BE FREELY DISTRIBUTED IN WHOLE. NO RIGHTS ARE
- RESERVED OR EXPRESS OR IMPLIED WARANTEE GIVEN.
- REVISION
- DESCRIPTION
- DATE
- APPROVED
- ENG:
- APPROVALS
- PROJECT
- DSN:
- CHK:
- REFERENCE DOCUMENTS
- PROJECT REVISION:
- TITLE
- DOCUMENT REVISION:
- DESIGN ITEM:
- BOM:
- FAB DWG:
- PCB DWG:
- ASSY DWG:
- SCALE:
- A2
- SIZE
- CAGE CODE
- FILE NAME
- DWG NO.
- SHEET
- OF
- REV
- (in symbol CMP-001-000983-8, part E) i.MX8MP - CSI

### Library data of the parts
U1 = CMP-001-000983-8: as U1 on sheet IMX8_DISPLAY; ComponentLink1Description: 1_Datasheet; ComponentLink1URL: https://www.nxp.com/part/MIMX8ML8CVNKZAB#/; ComponentLink2Description: 2_Product page; ComponentLink3Description: 3_X-information; ComponentLink4Description: 4_X-information; Creation date: 20240524; Dimensions WxLxH: 15 x 15 x 1.33mm; Operating temperature range: -40... +105 °C; Package: FCBGA548; Part Number: MIMX8ML8CVNKZAB; ClassName: BIG; Source: UUDET_KOMPONENTIT.SchLib; Design Item ID: MIMX8ML8CVNKZAB; Manufacturer Part Number: MIMX8ML8CVNKZAB; Component Type: Processor